# EasyEDA schematic Mainboard Schematic - 0.3A.json

## Sheets
1 CPU: TITLE: Turaco: CPU; REV: 0.3A; Date: 2023-04-29; Drawn By: Kyle J Cardoza; Company: Studio 8502
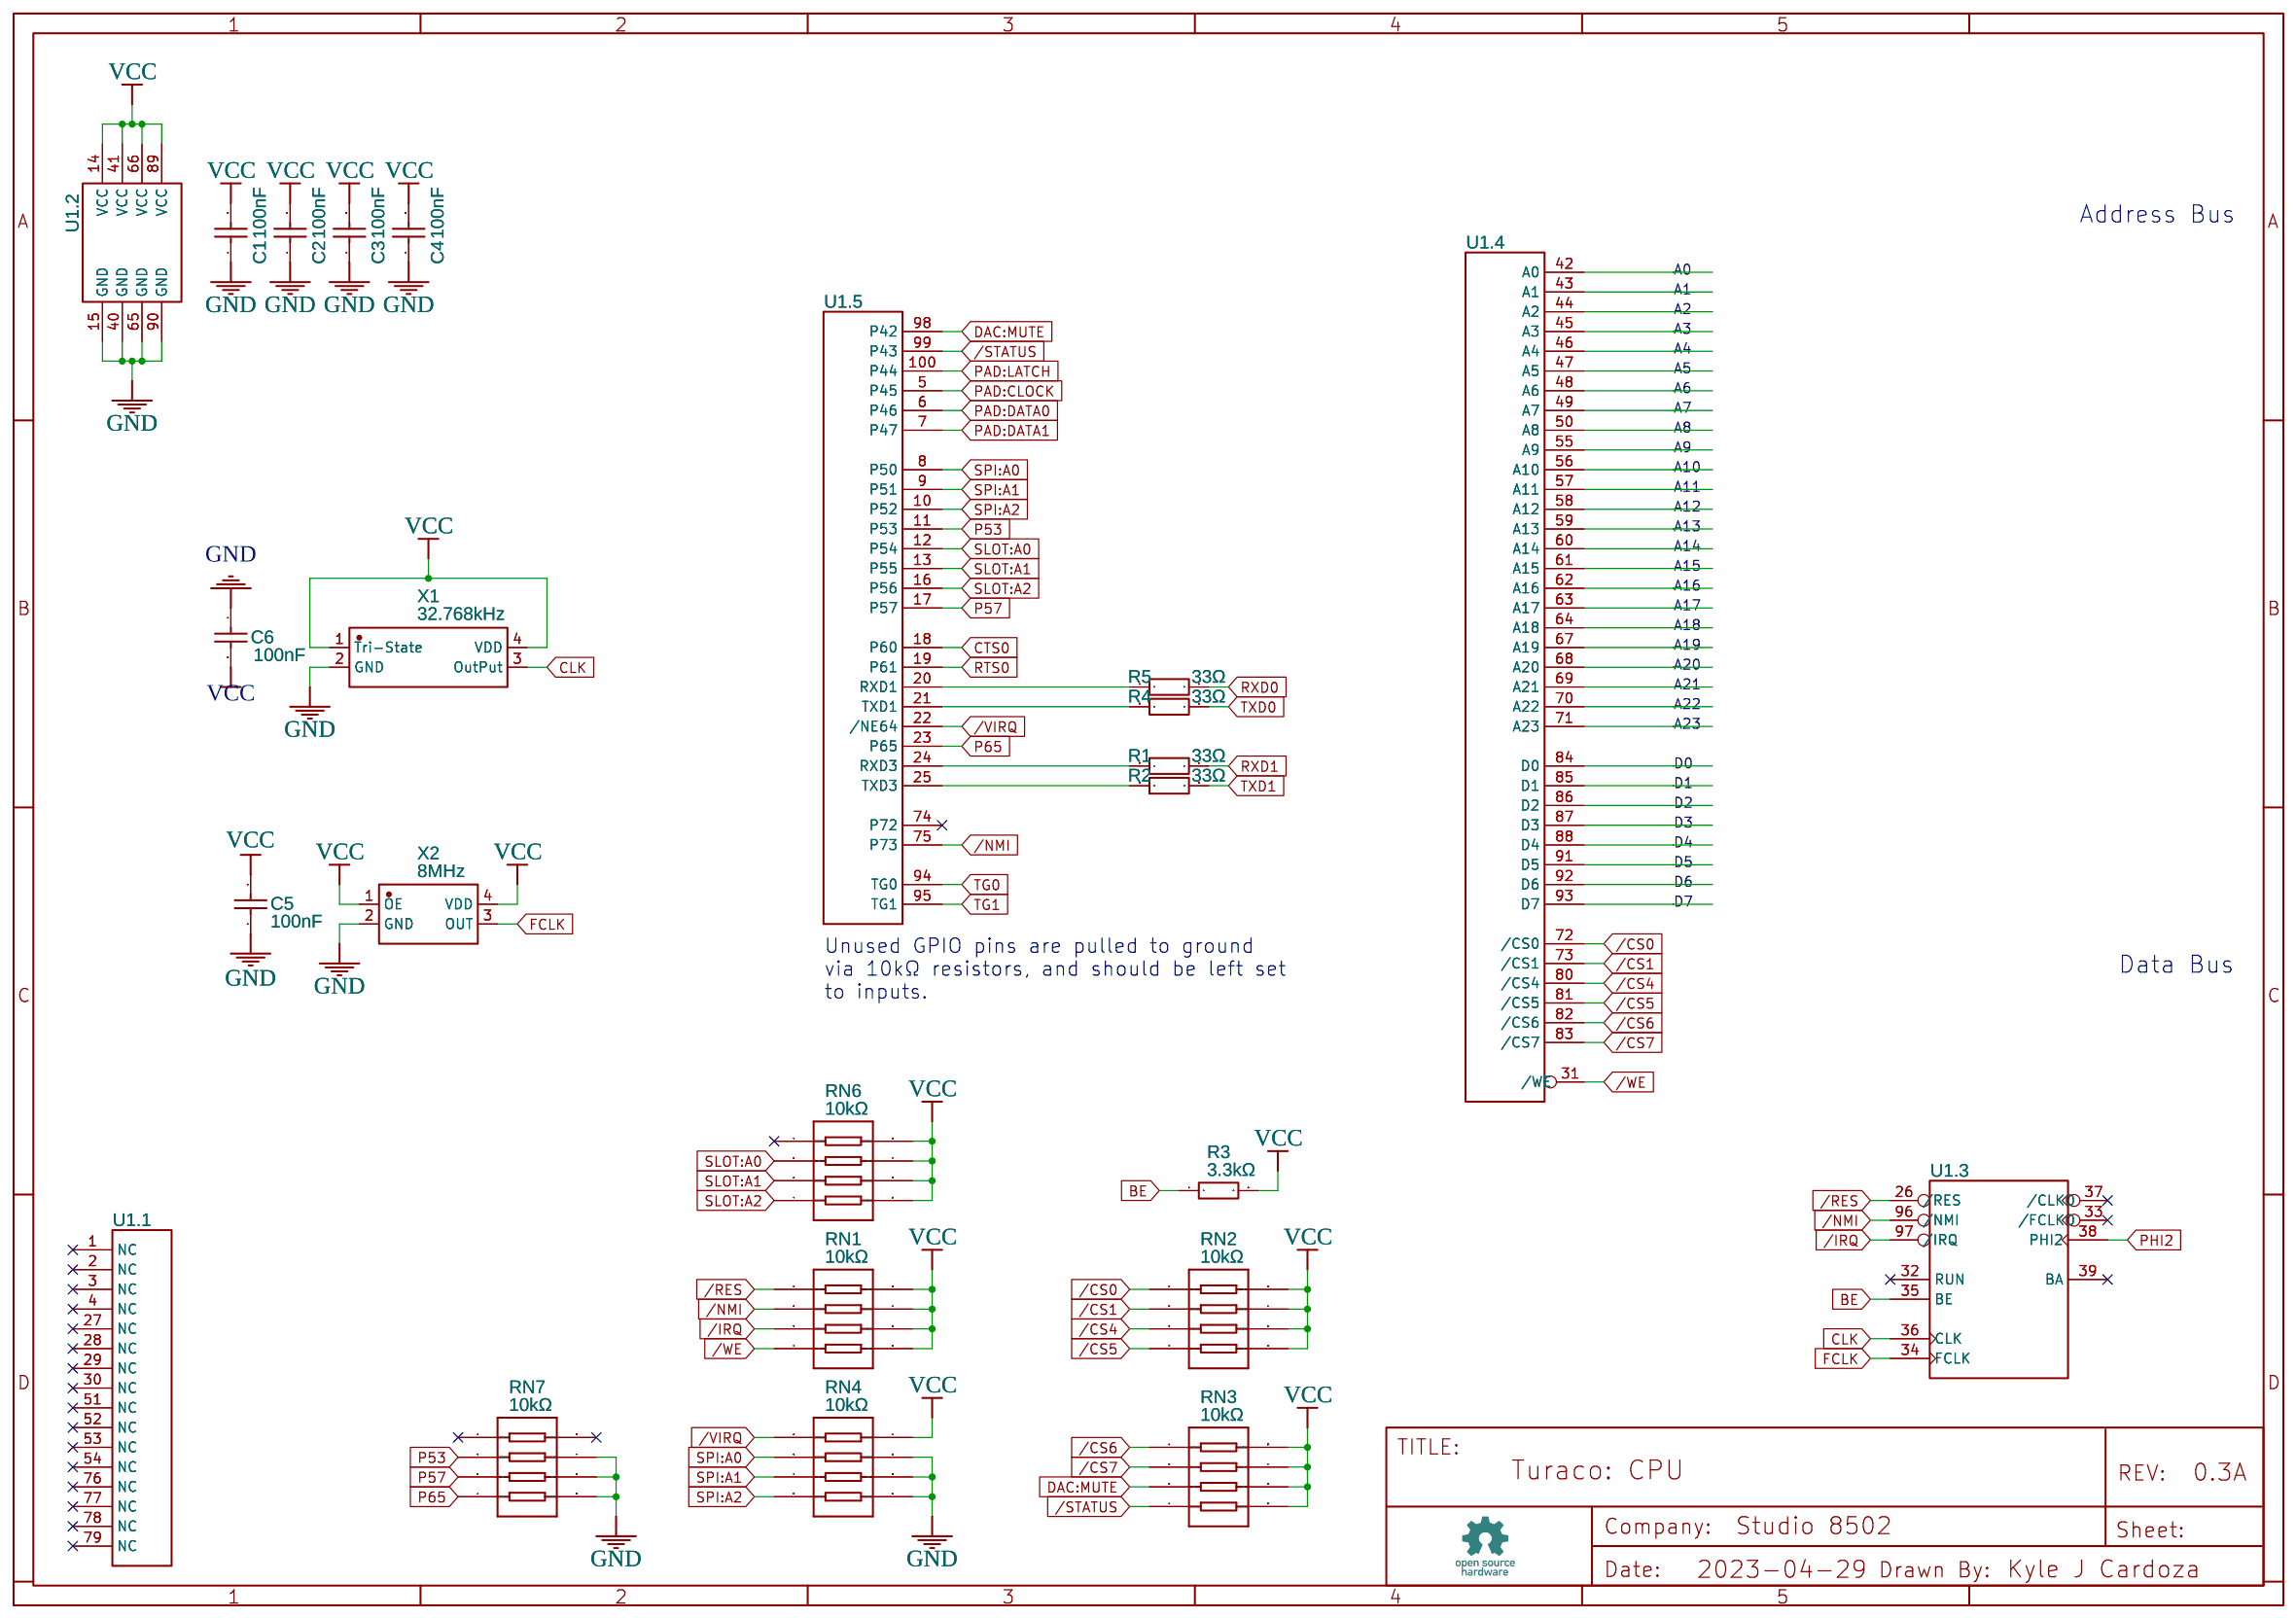
[diagram p0: CPU]
2 Glue Logic: TITLE: Turaco: Glue Logic
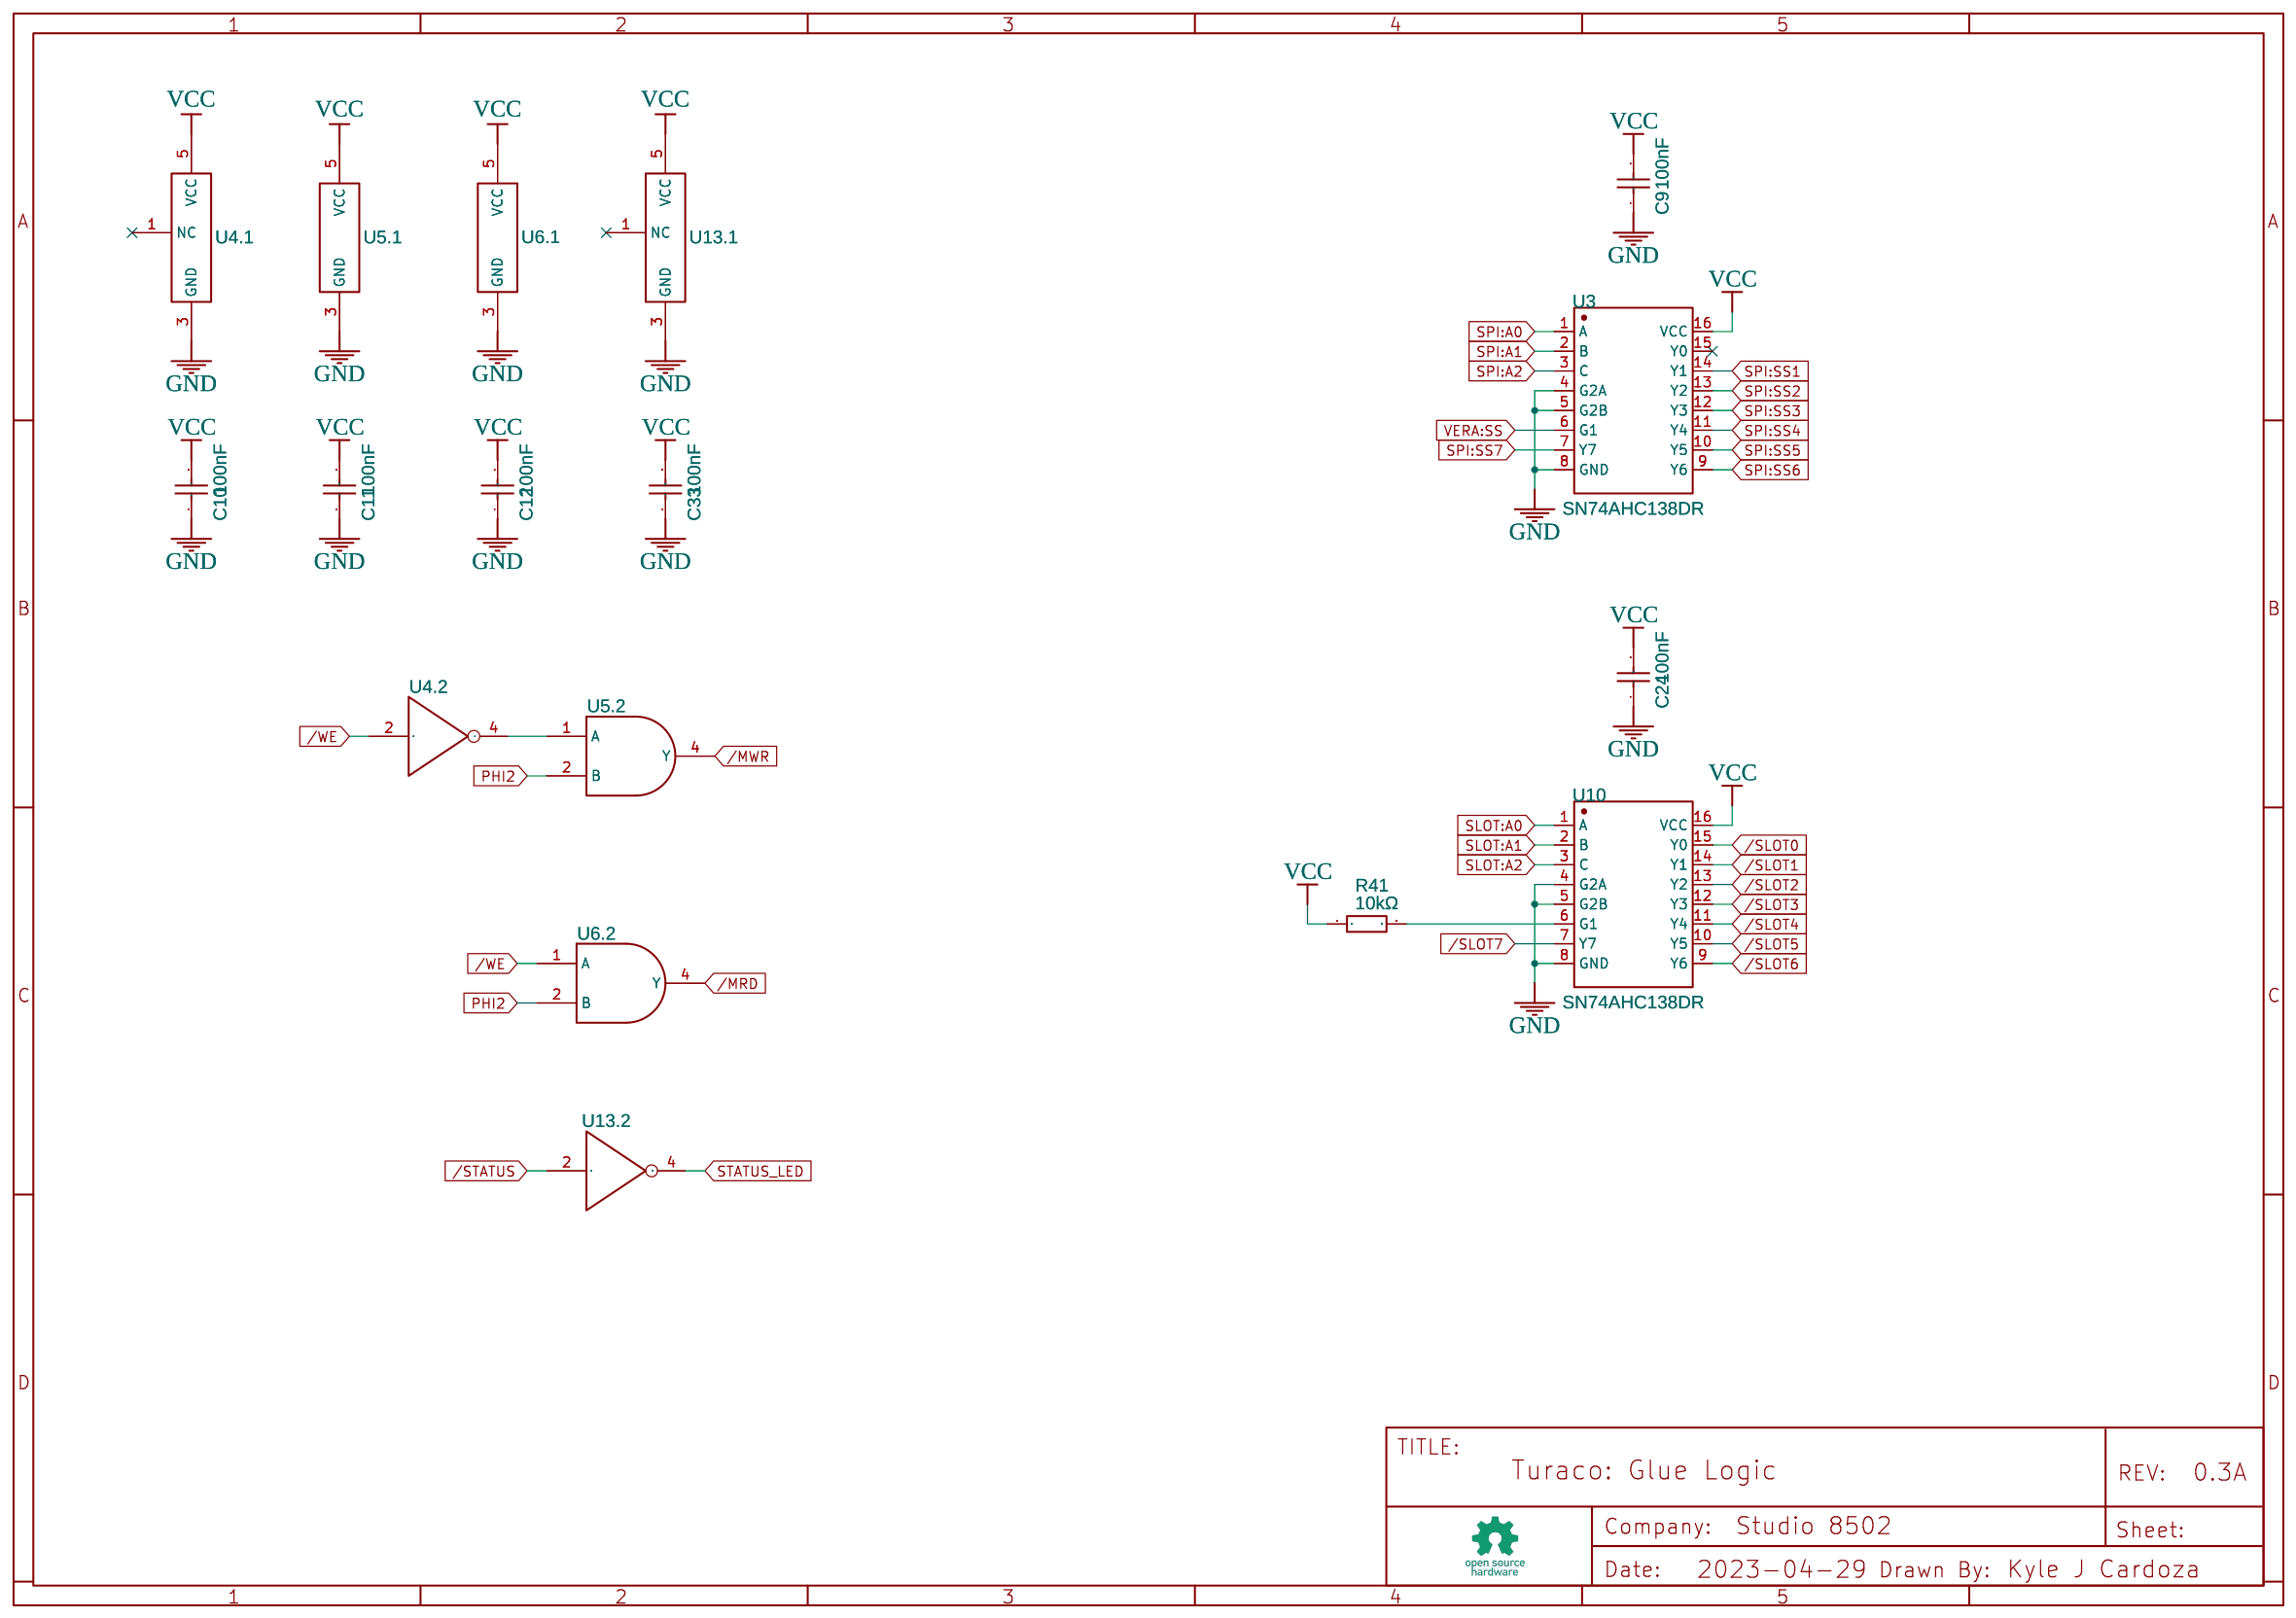
[diagram p1: Glue Logic]
3 Main Memory: TITLE: Main Memory
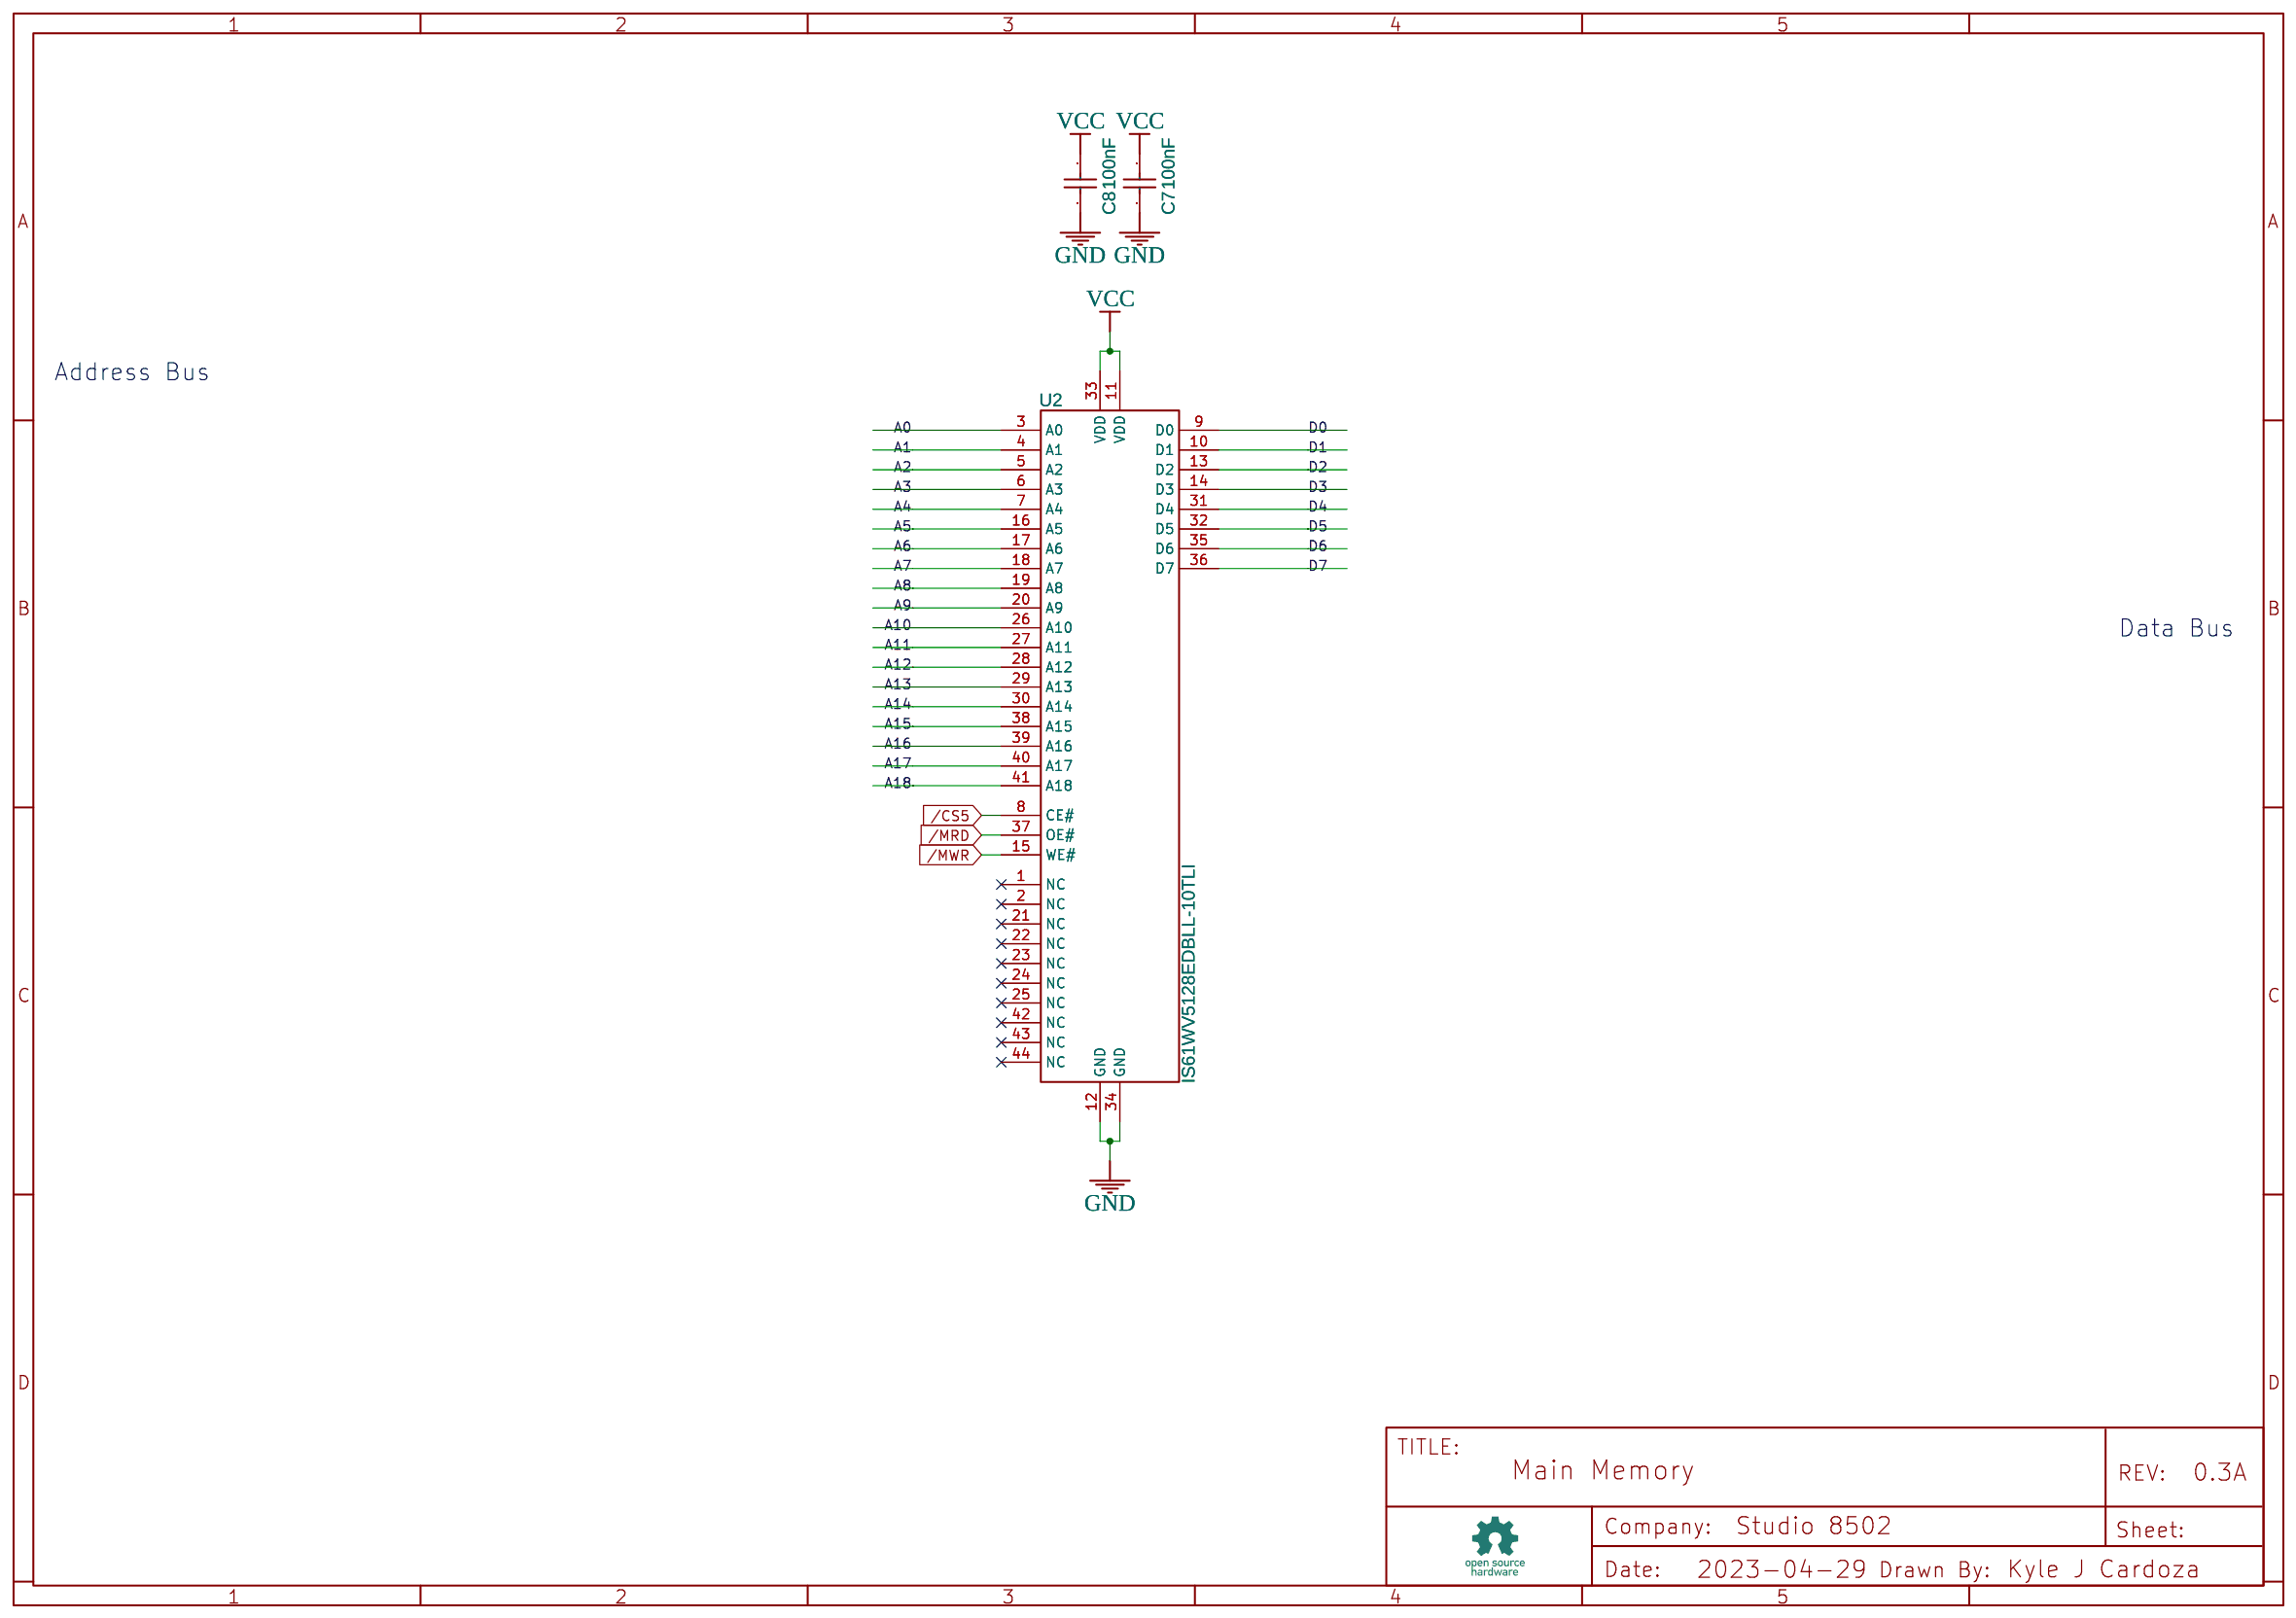
[diagram p2: Main Memory]
4 Video Controller: TITLE: Turaco: Video Controller
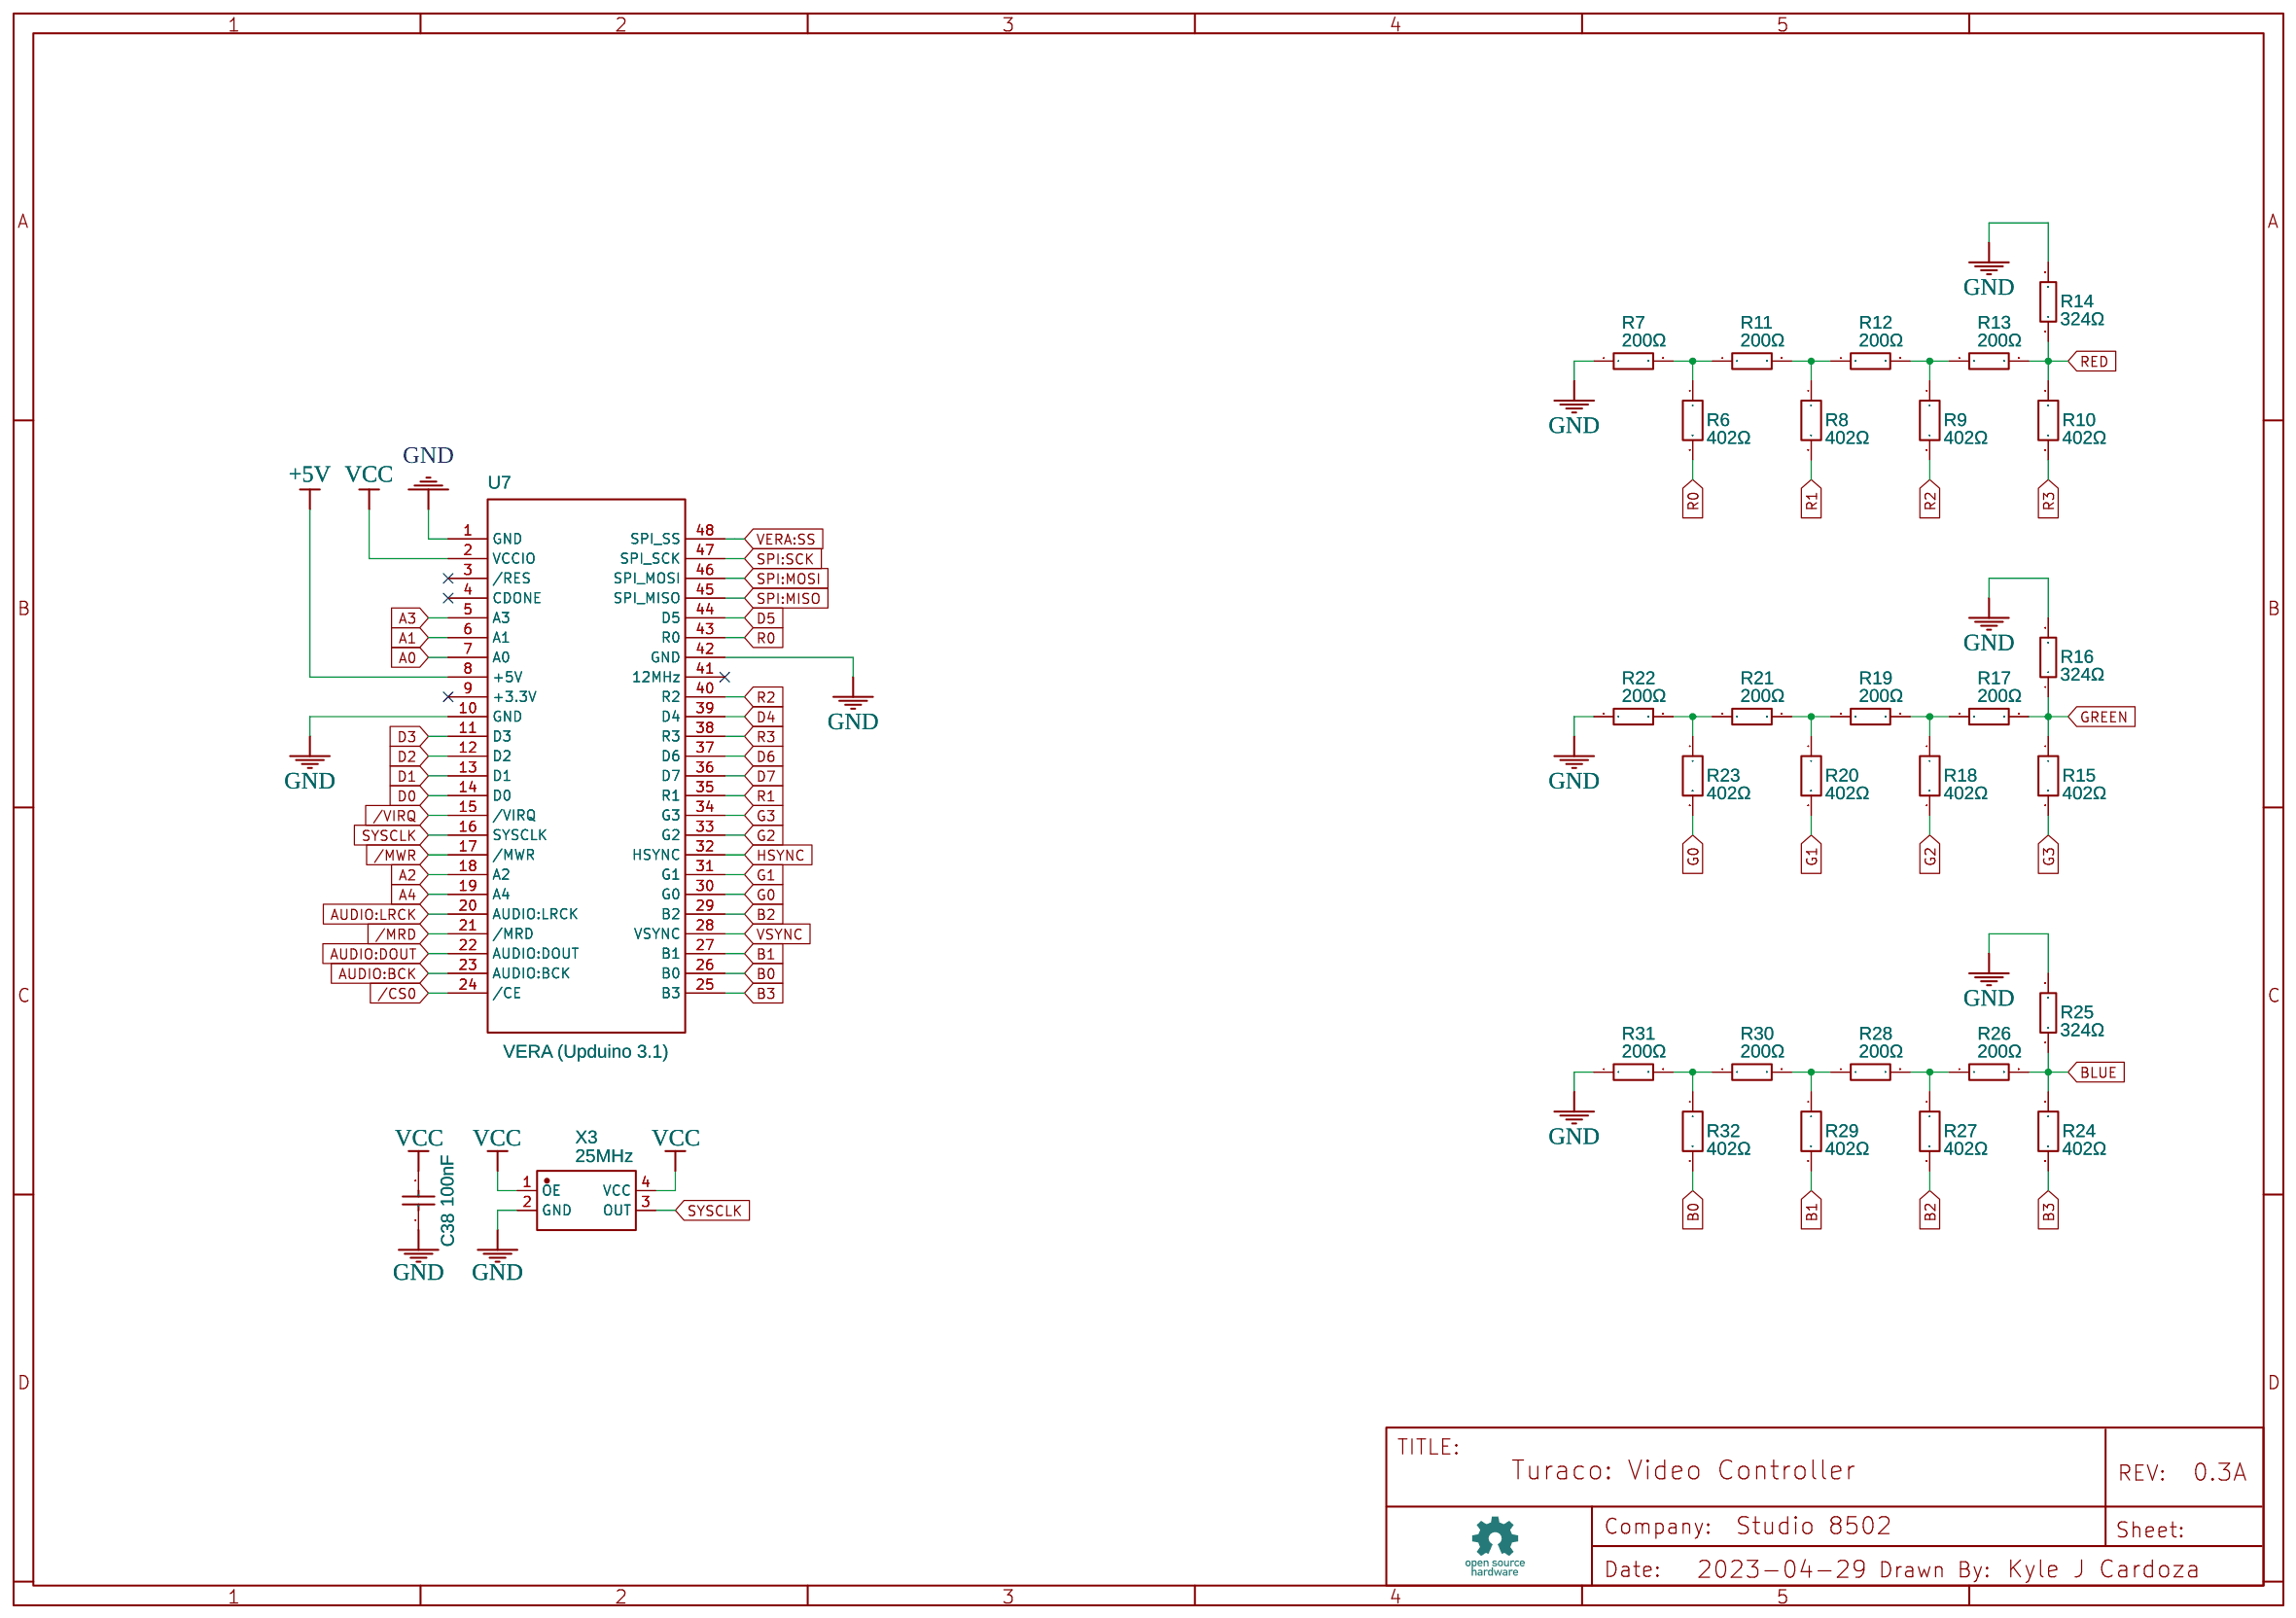
[diagram p3: Video Controller]
5 Keyboard Controller: TITLE: Turaco: Keyboard Controller
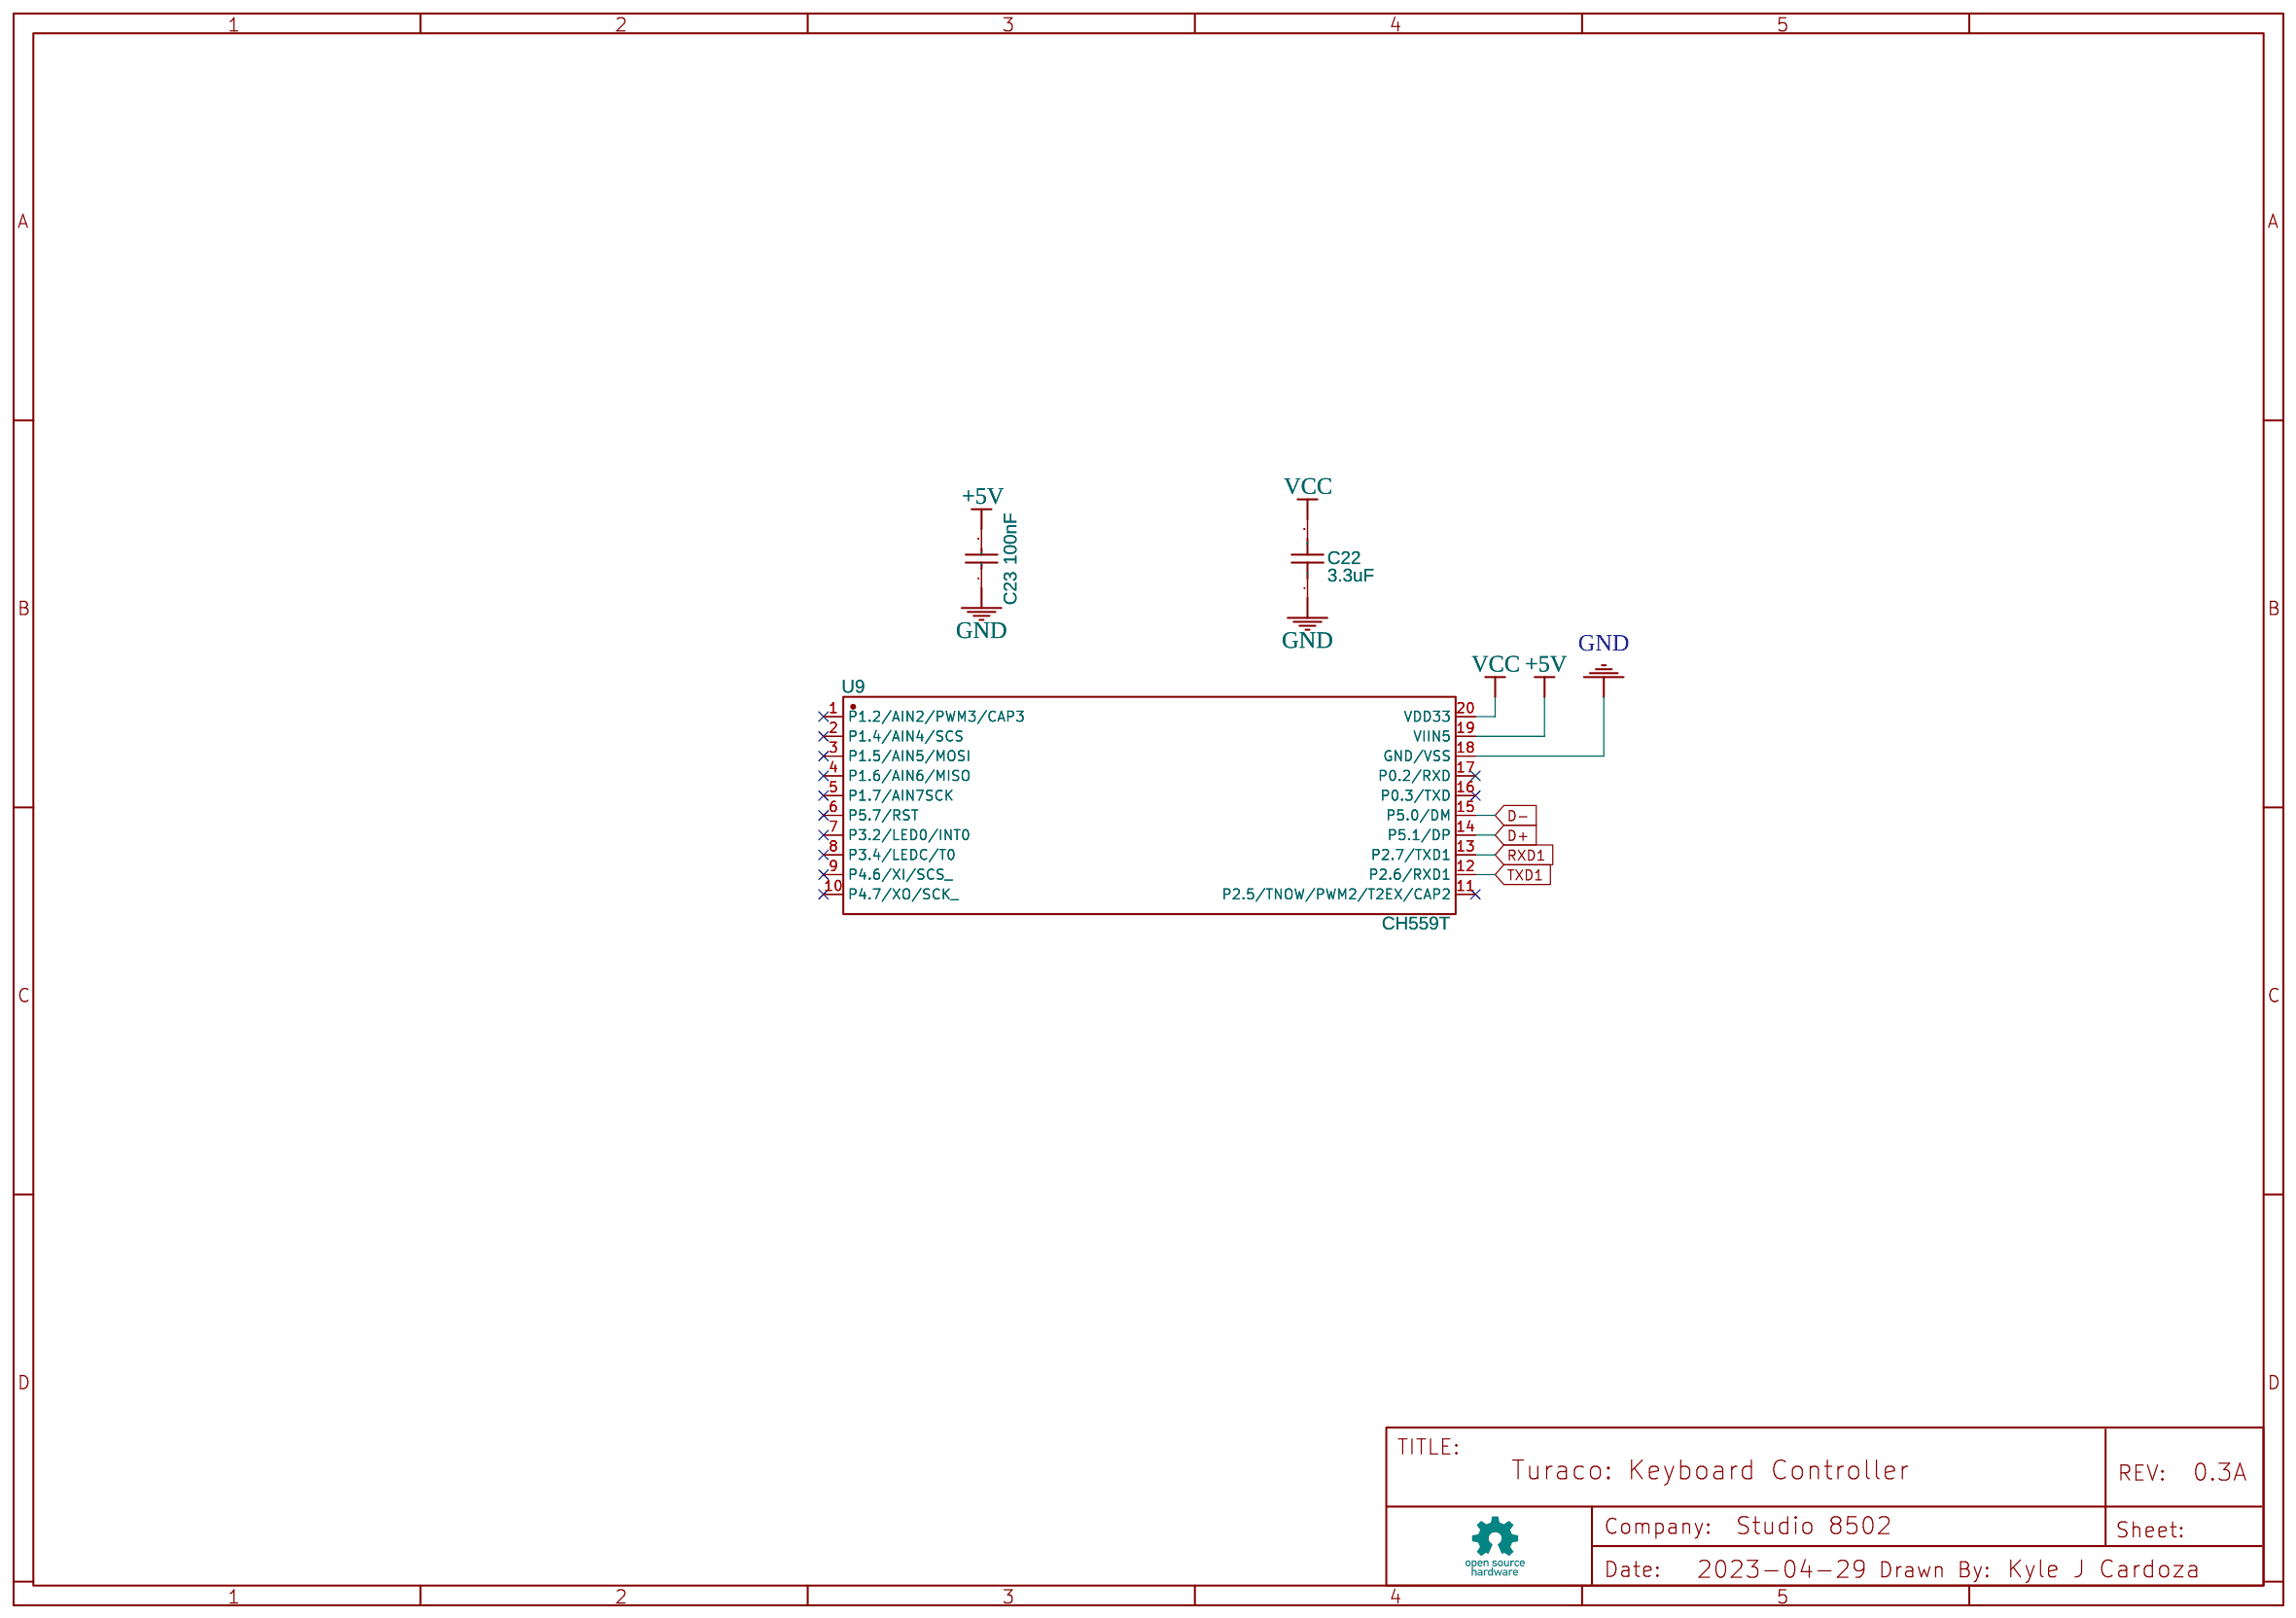
[diagram p4: Keyboard Controller]
6 Audio DAC: TITLE: Turaco: Audio
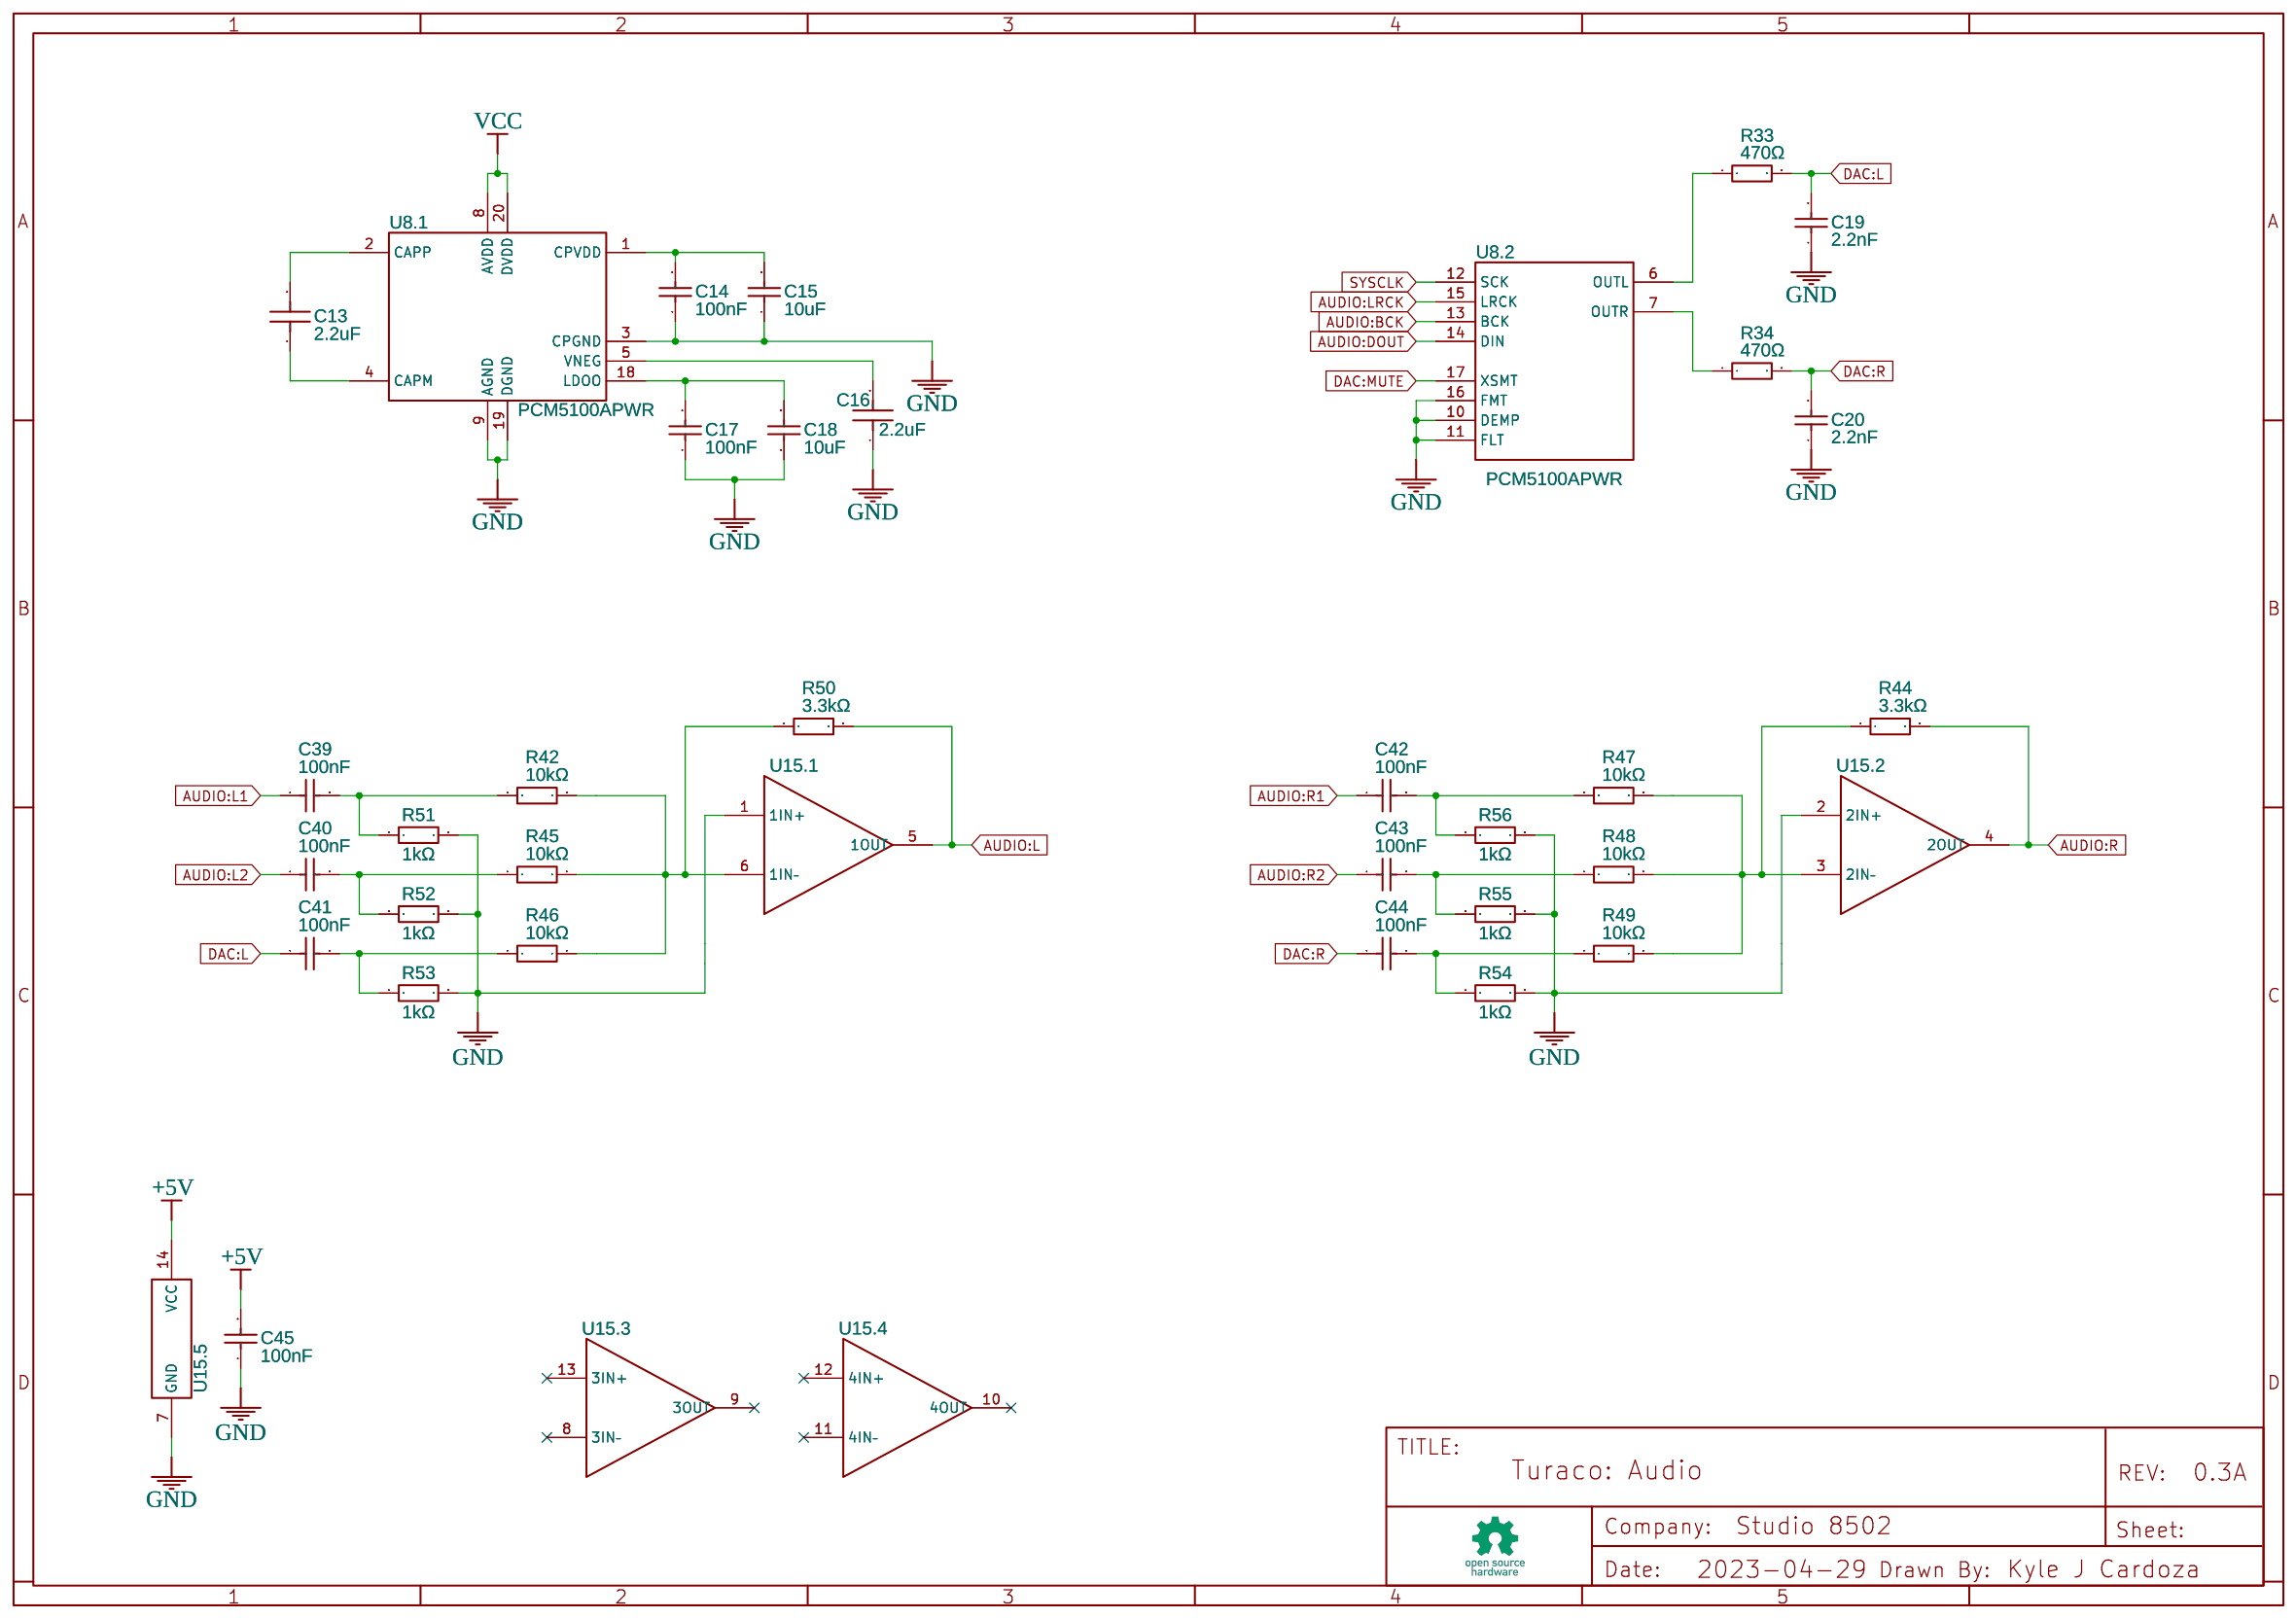
[diagram p5: Audio DAC]
7 RTC: TITLE: RTC; Date: 2023-05-05
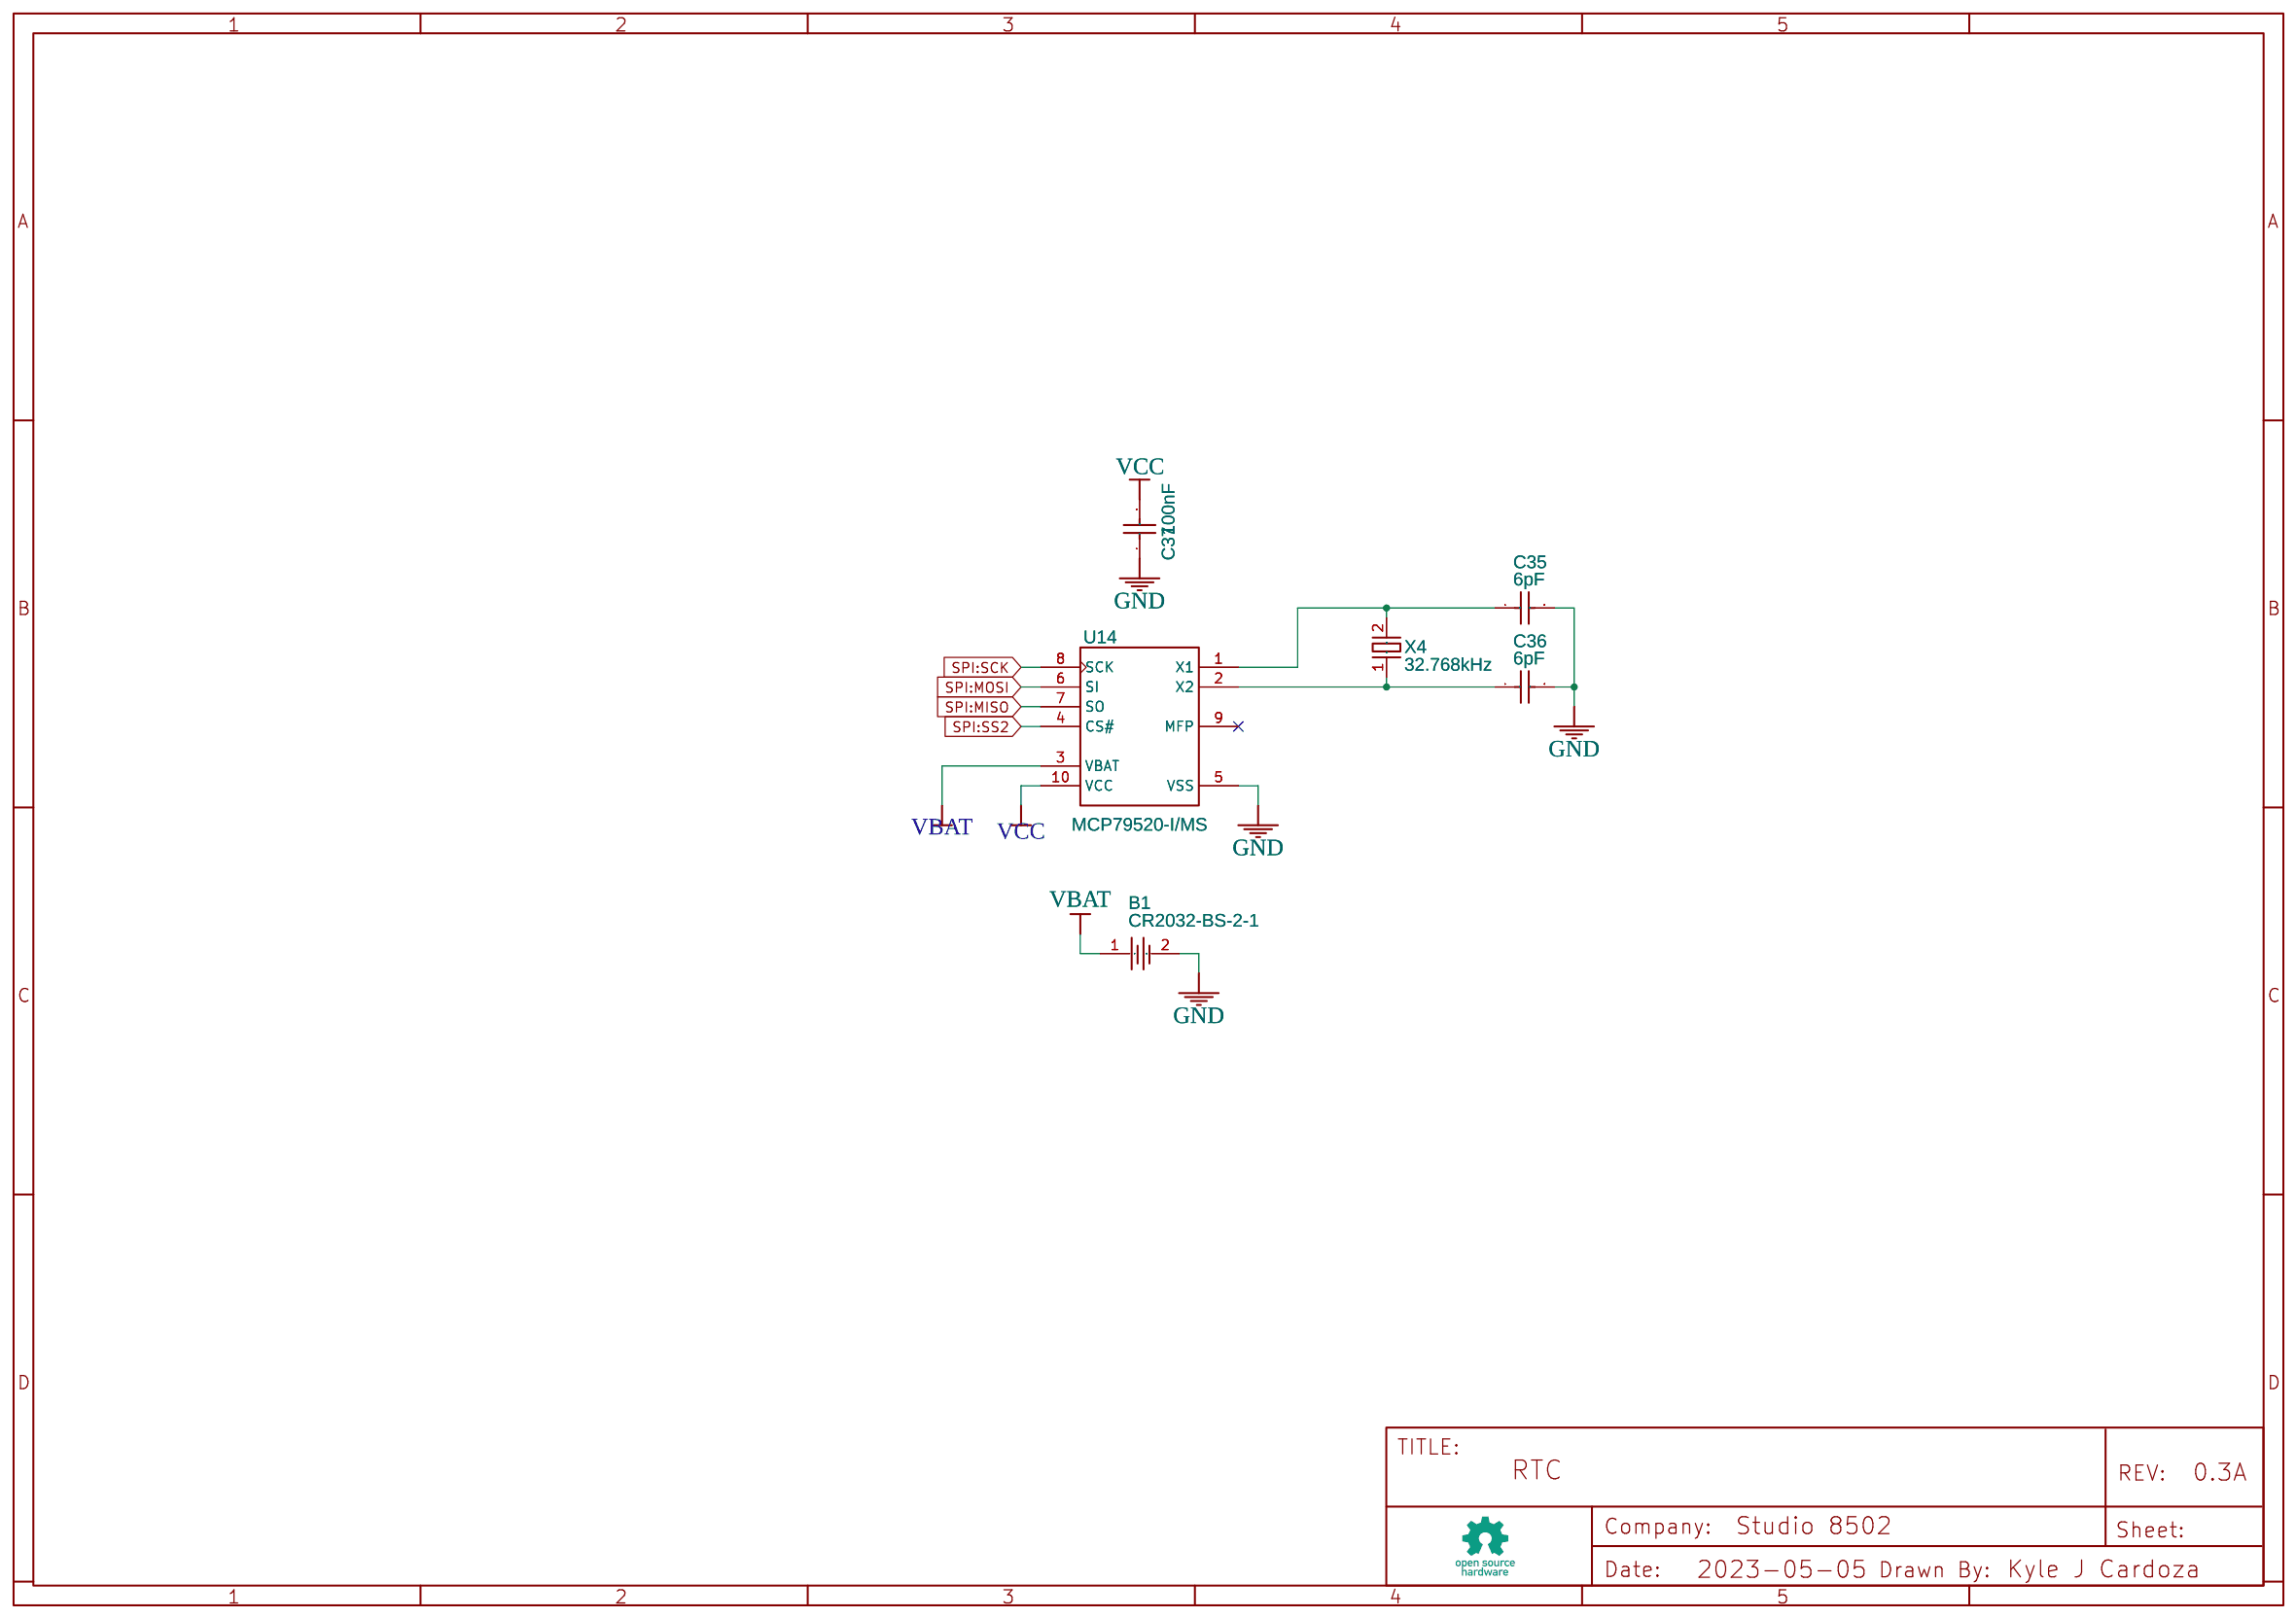
[diagram p6: RTC]
8 Expansion: TITLE: Turaco: Expansion
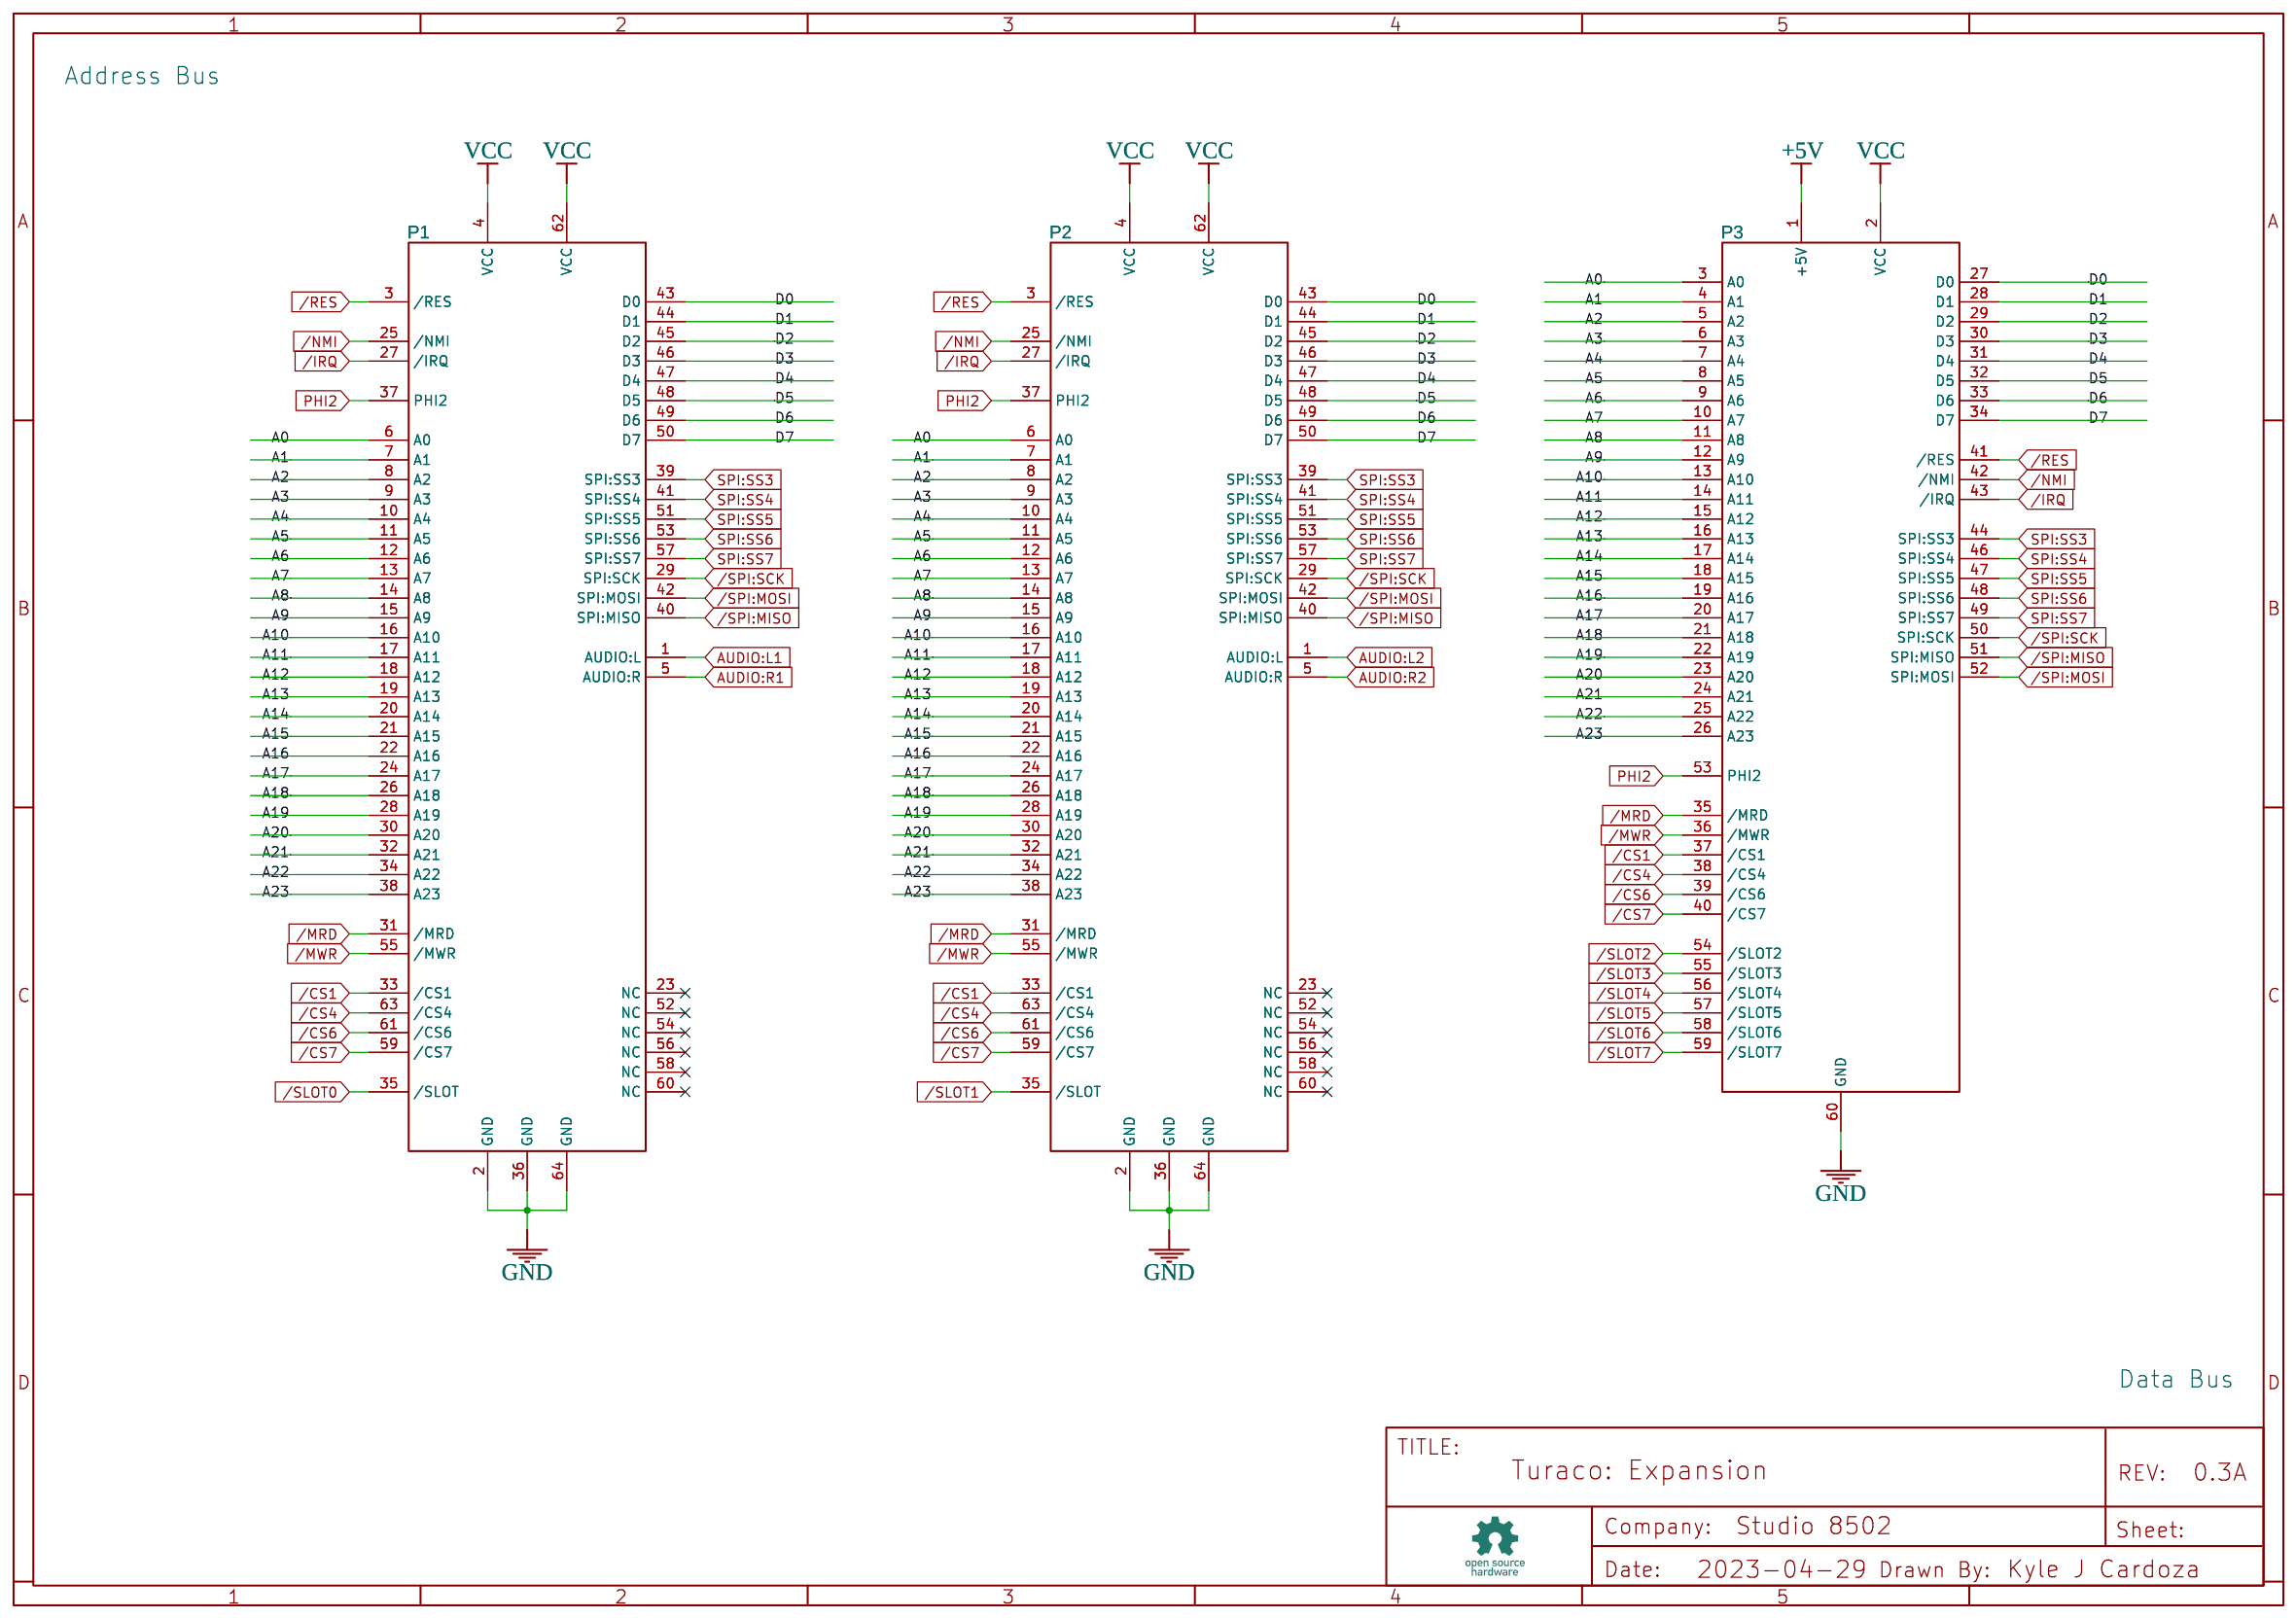
[diagram p7: Expansion]
9 Ports: TITLE: Turaco: Ports
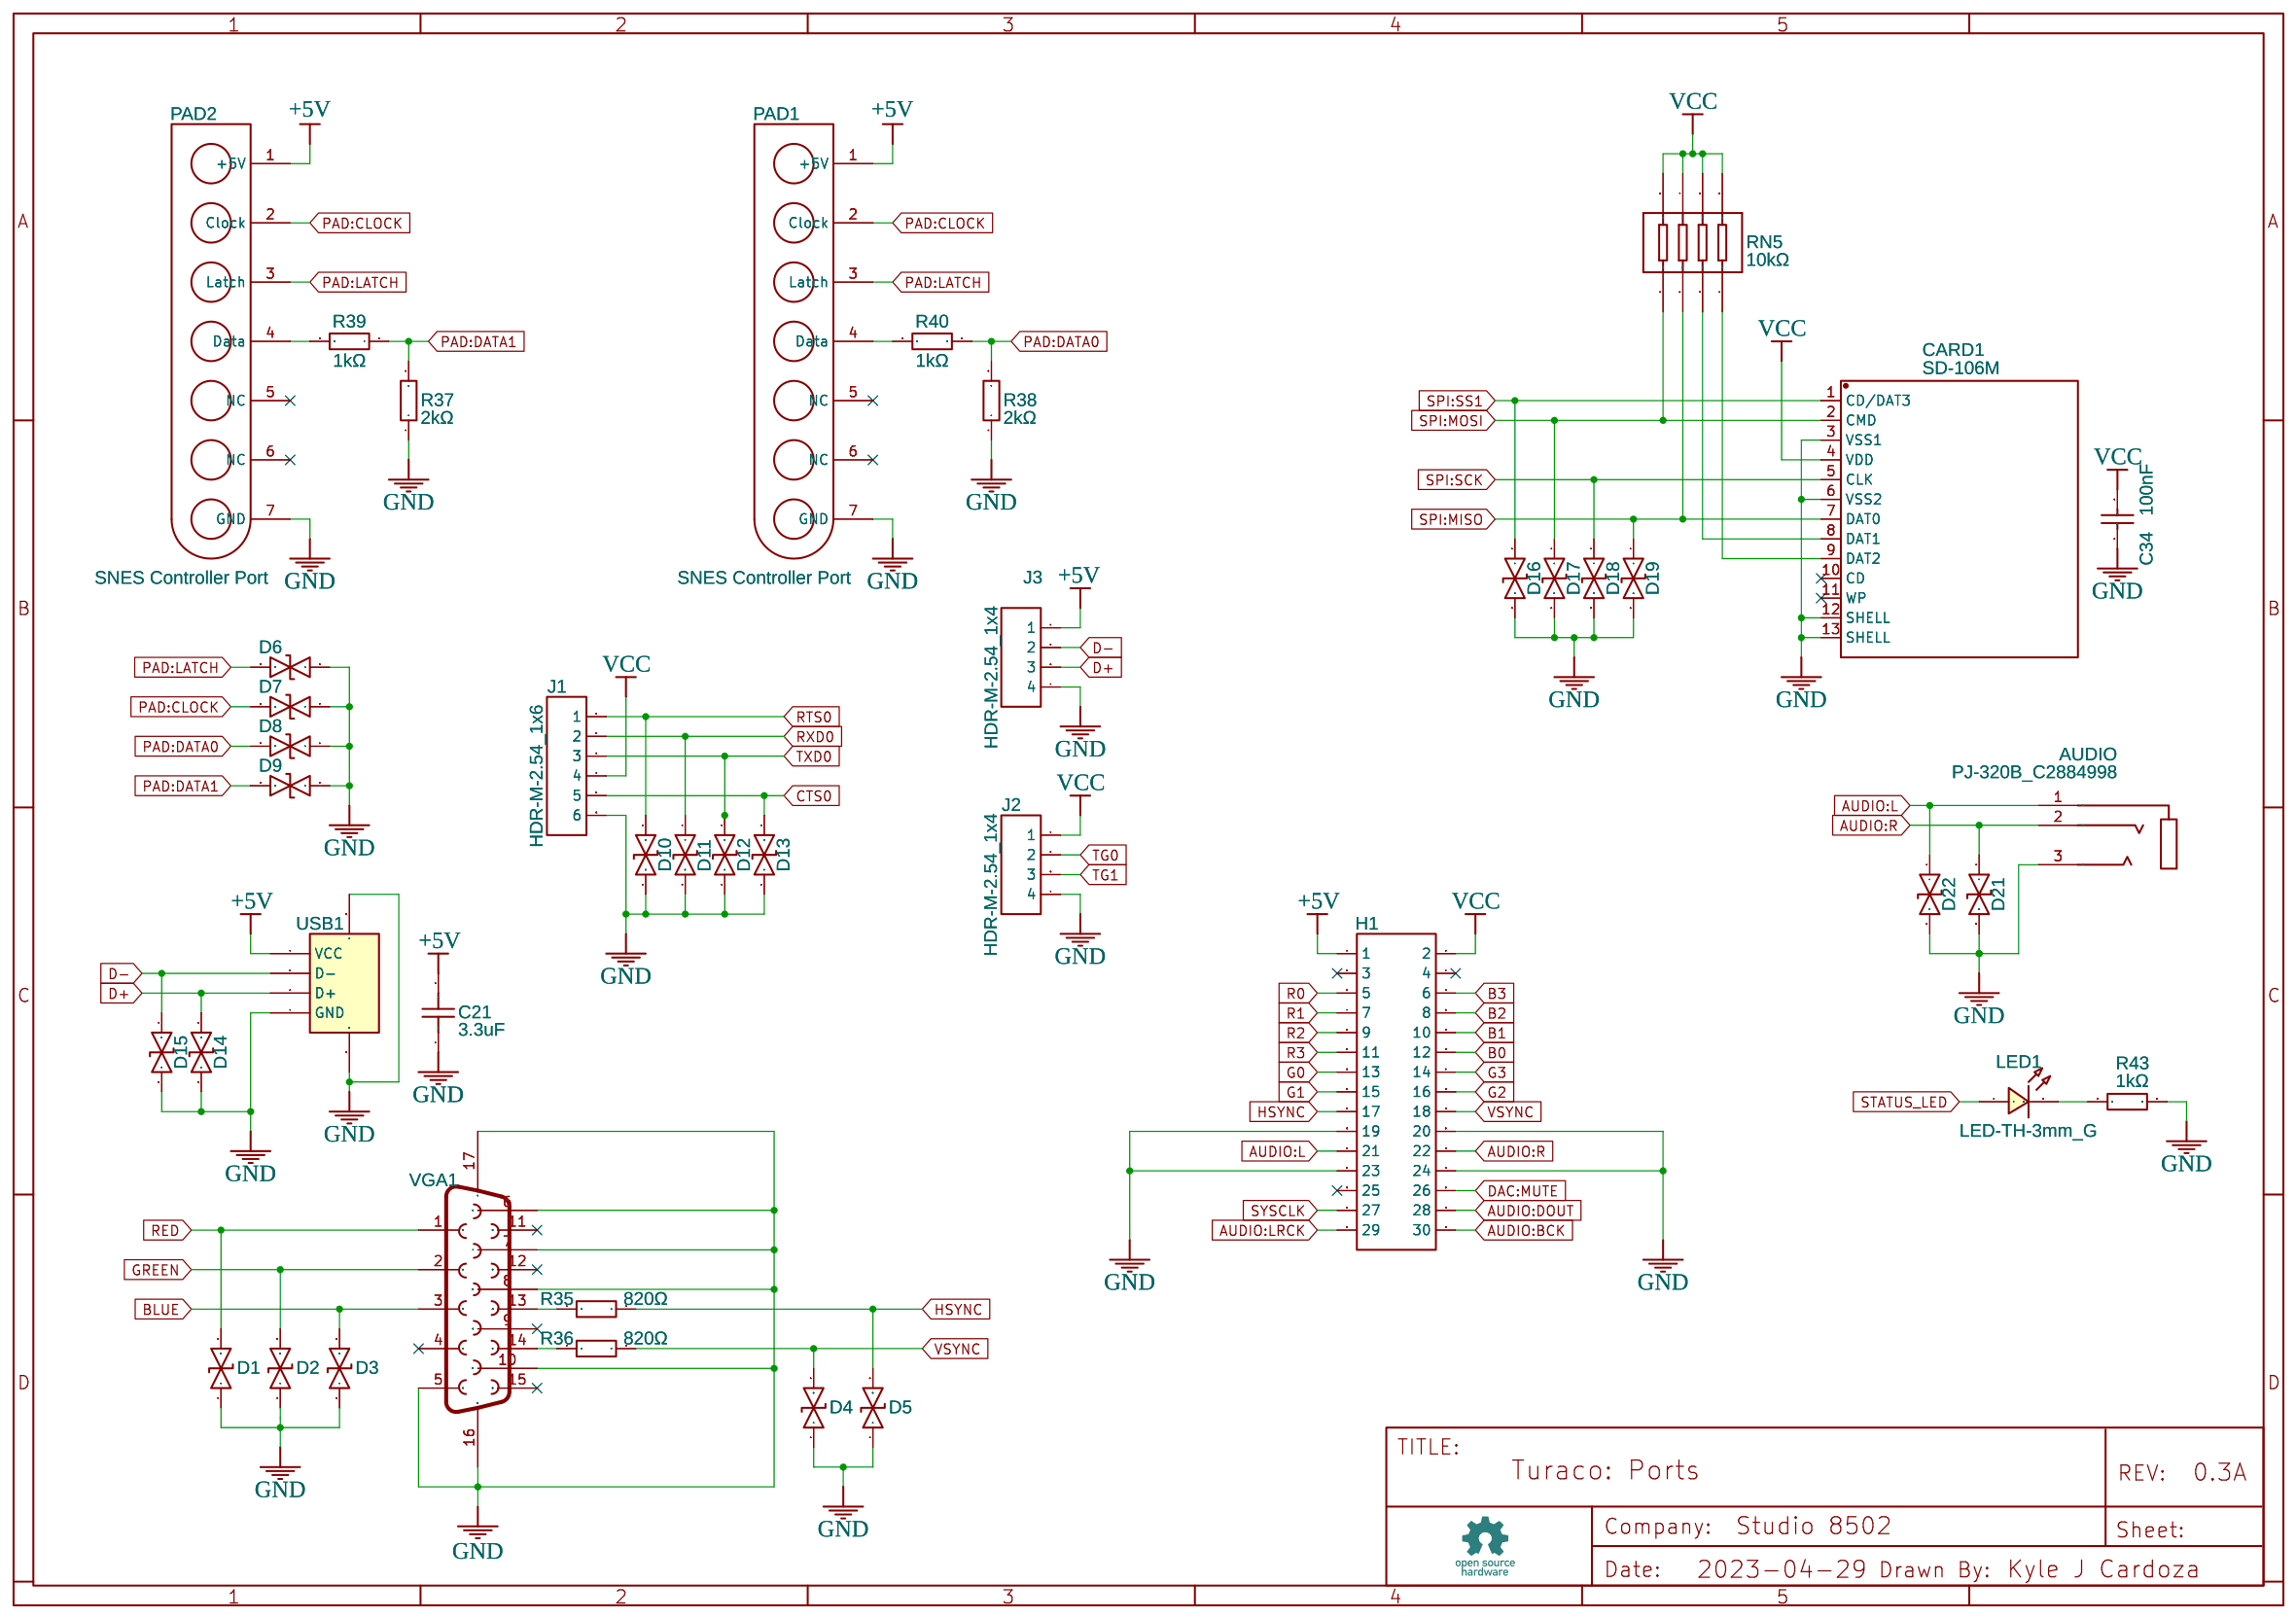
[diagram p8: Ports]
10 Power Supply: TITLE: Turaco: Power Supply
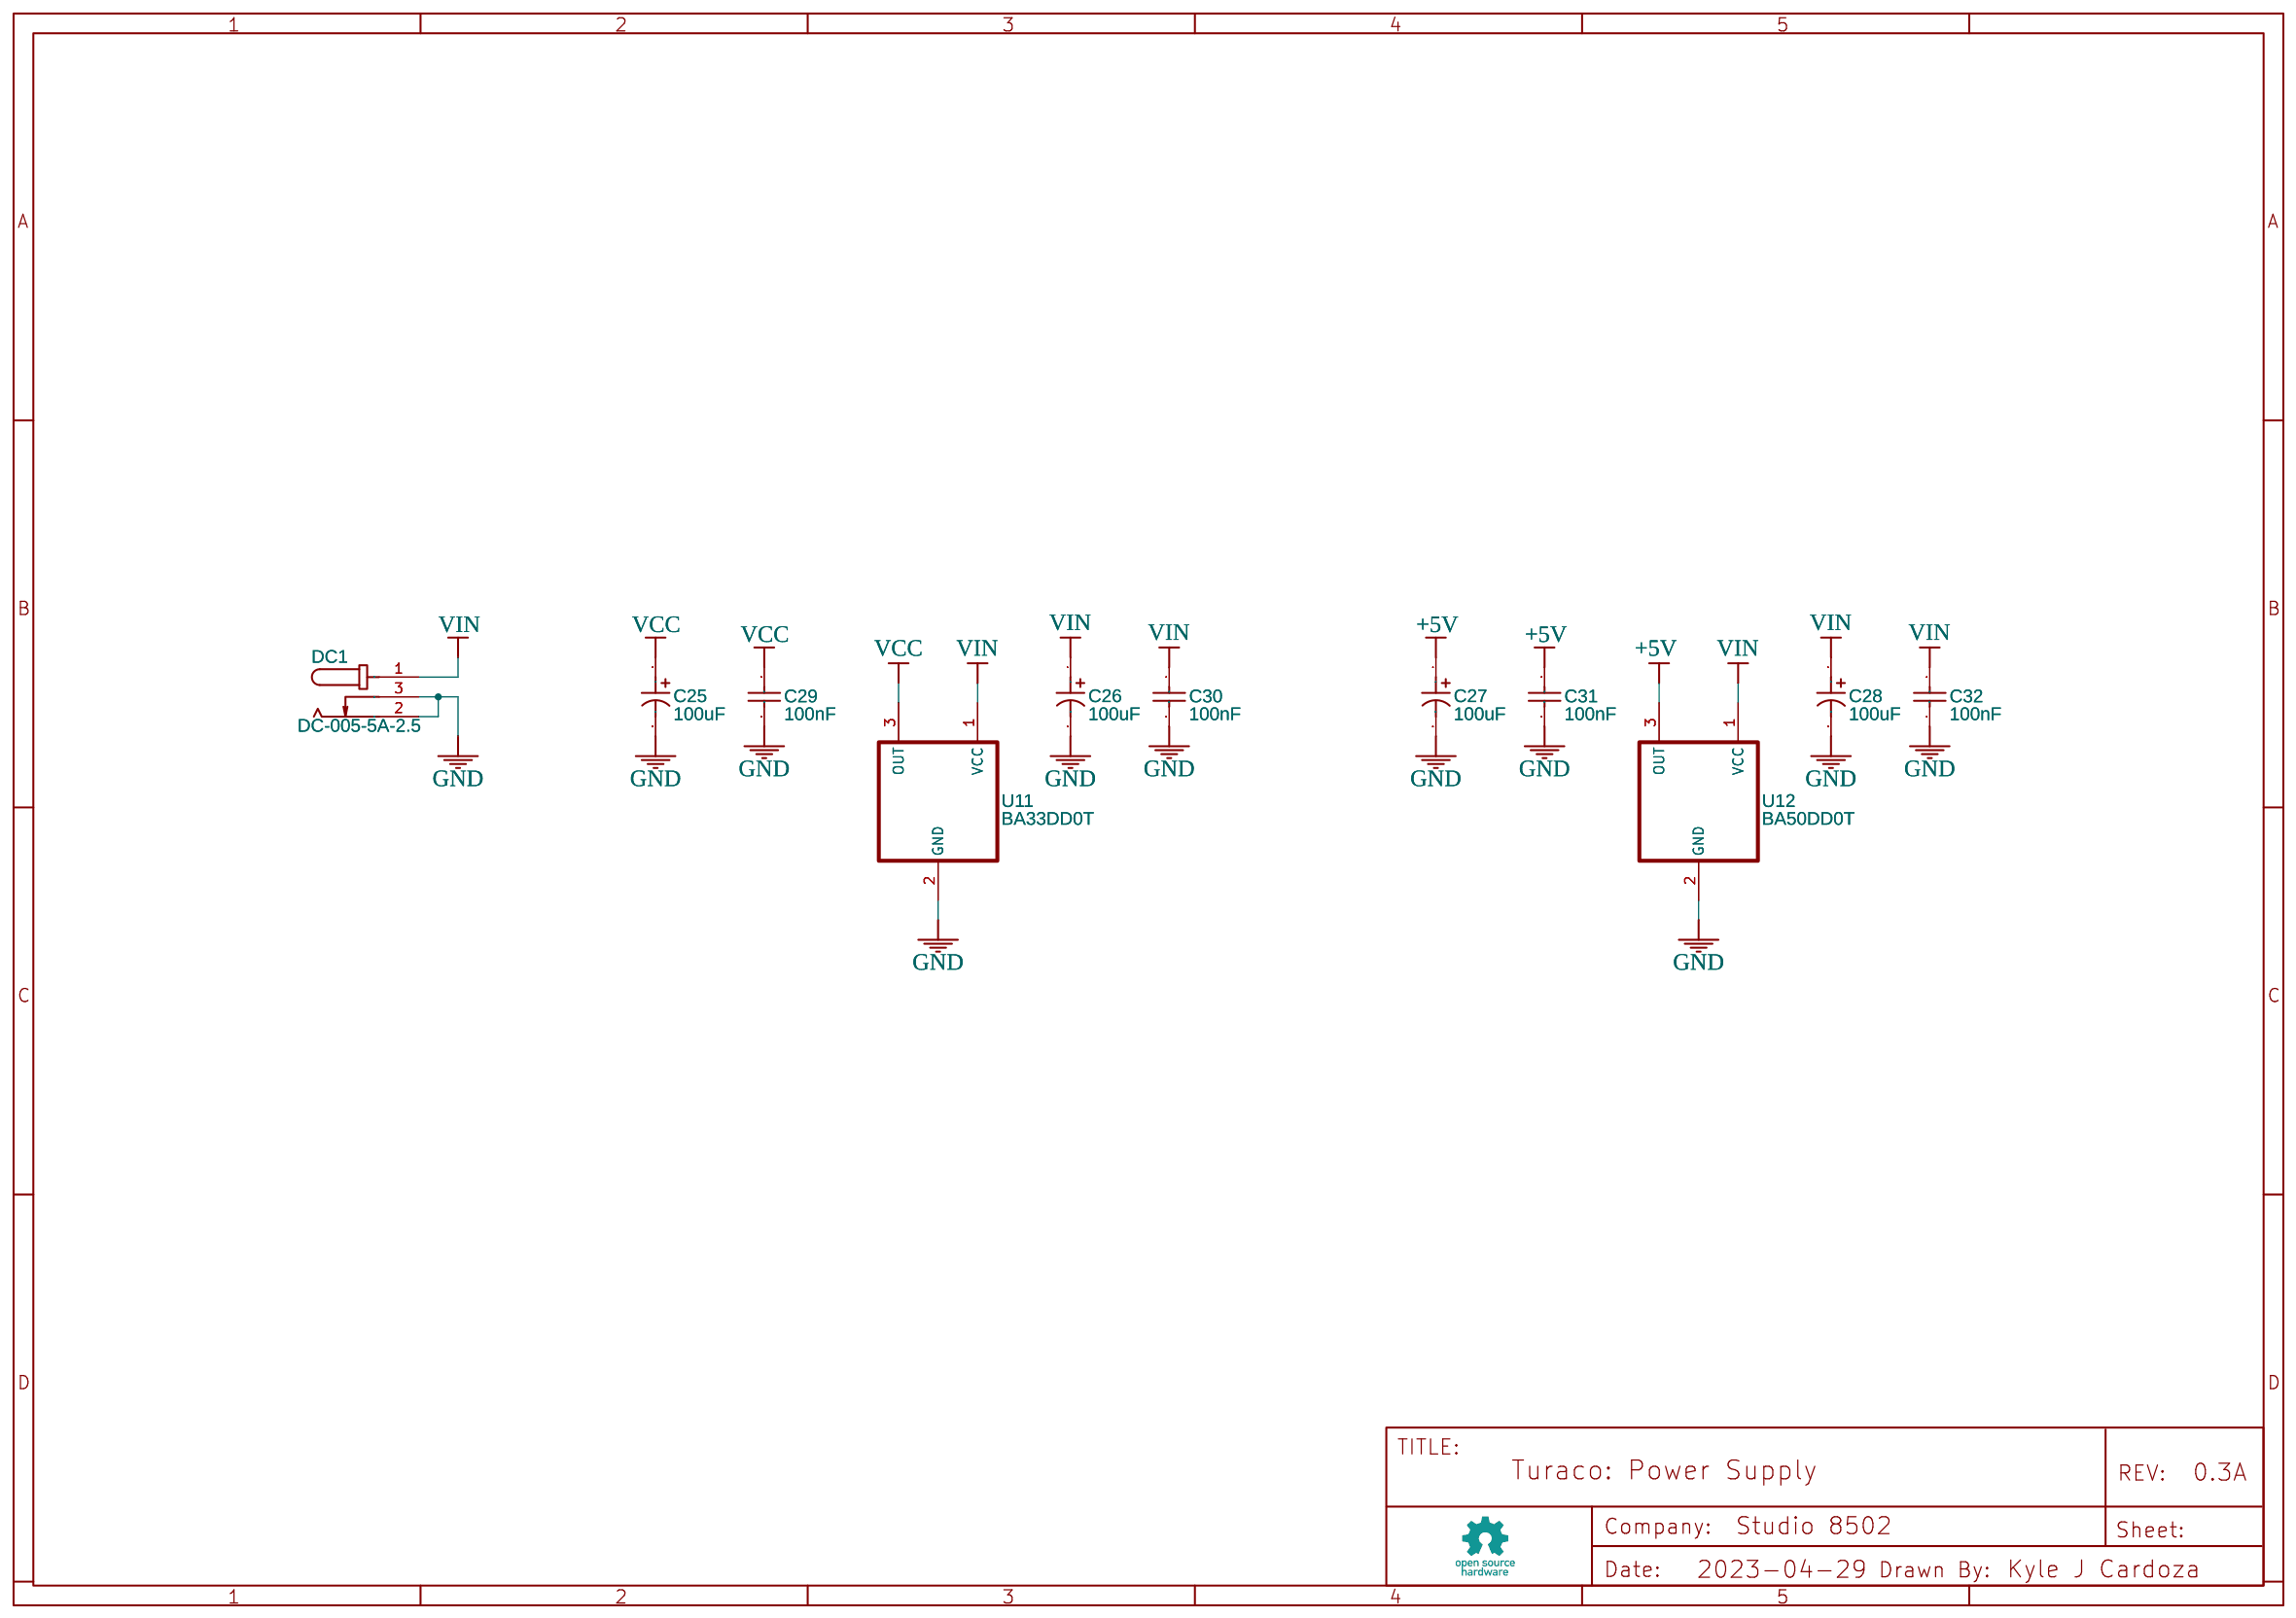
[diagram p9: Power Supply]

## Parts
sheet Audio DAC
C13  2.2uF  [C0402]
C14  100nF  [C0402]
C15  10uF  [C0805]
C16  2.2uF  [C0402]
C17  100nF  [C0402]
C18  10uF  [C0805]
C19  2.2nF  [C0402]
C20  2.2nF  [C0402]
C39  100nF  [C0402]
C40  100nF  [C0402]
C41  100nF  [C0402]
C42  100nF  [C0402]
C43  100nF  [C0402]
C44  100nF  [C0402]
C45  100nF  [C0402]
R33  470Ω  [R0402]
R34  470Ω  [R0402]
R42  10kΩ  [R0402]
R44  3.3kΩ  [R0402]
R45  10kΩ  [R0402]
R46  10kΩ  [R0402]
R47  10kΩ  [R0402]
R48  10kΩ  [R0402]
R49  10kΩ  [R0402]
R50  3.3kΩ  [R0402]
R51  1kΩ  [R0402]
R52  1kΩ  [R0402]
R53  1kΩ  [R0402]
R54  1kΩ  [R0402]
R55  1kΩ  [R0402]
R56  1kΩ  [R0402]
U8  PCM5100APWR  [TSSOP-20_L6.5-W4.4-P0.65-LS6.4-BL]  (sections 1,2)
U15  LM3900DR  [SOIC-14_L8.7-W3.9-P1.27-LS6.0-BL]  (sections 1,2,3,4,5)
sheet CPU
C1  100nF  [C0402]
C2  100nF  [C0402]
C3  100nF  [C0402]
C4  100nF  [C0402]
C5  100nF  [C0402]
C6  100nF  [C0402]
R1  33Ω  [R0402]
R2  33Ω  [R0402]
R3  3.3kΩ  [R0402]
R4  33Ω  [R0402]
R5  33Ω  [R0402]
RN1  10kΩ  [RES-ARRAY-SMD_0402-8P-L2.0-W1.0-BL]
RN2  10kΩ  [RES-ARRAY-SMD_0402-8P-L2.0-W1.0-BL]
RN3  10kΩ  [RES-ARRAY-SMD_0402-8P-L2.0-W1.0-BL]
RN4  10kΩ  [RES-ARRAY-SMD_0402-8P-L2.0-W1.0-BL]
RN6  10kΩ  [RES-ARRAY-SMD_0402-8P-L2.0-W1.0-BL]
RN7  10kΩ  [RES-ARRAY-SMD_0402-8P-L2.0-W1.0-BL]
U1  W65C265S8QG-8  [TQFP-100_L14.0-W14.0-P0.50-LS16.0-BL-EP9.5]  (sections 1,2,3,4,5)
X1  32.768kHz  [OSC-SMD_4P-L3.2-W2.5-BL-1]
X2  8MHz  [OSC-SMD_4P-L3.2-W2.5-BL]
sheet Expansion
P1  Turaco Cartridge (Female Edge Connector)  [EDAC 395-062-520-350 EDGE CONNECTOR - F-62P-P2.54]
P2  Turaco Cartridge (Female Edge Connector)  [EDAC 395-062-520-350 EDGE CONNECTOR - F-62P-P2.54]
P3  TURACO BACKPLANE (MALE EDGE CONNECTOR)  [TURACO BACKPLANE CONNECTOR (MALE - 60P - P2.54MM) COPY]
sheet Glue Logic
C9  100nF  [C0402]
C10  100nF  [C0402]
C11  100nF  [C0402]
C12  100nF  [C0402]
C24  100nF  [C0402]
C33  100nF  [C0402]
R41  10kΩ  [R0402]
U3  SN74AHC138DR  [SOIC-16_L10.8-W4.5-P1.27-LS6.8-BL]
U4  SN74AHC1G04DCKR (NOT GATE)  [SOT-353_L2.1-W1.3-P0.65-LS2.3-BR]  (sections 1,2)
U5  SN74AHC1G08DCKR (AND GATE)  [SC-70-5_L2.1-W1.3-P0.65-LS2.1-BR]  (sections 1,2)
U6  SN74AHC1G08DCKR (AND GATE)  [SC-70-5_L2.1-W1.3-P0.65-LS2.1-BR]  (sections 1,2)
U10  SN74AHC138DR  [SOIC-16_L10.8-W4.5-P1.27-LS6.8-BL]
U13  SN74AHC1G04DCKR (NOT GATE)  [SOT-353_L2.1-W1.3-P0.65-LS2.3-BR]  (sections 1,2)
sheet Keyboard Controller
C22  3.3uF  [C0402]
C23  100nF  [C0402]
U9  CH559T  [SSOP-20_L7.5-W5.2-P0.65-LS8.0-BL]
sheet Main Memory
C7  100nF  [C0402]
C8  100nF  [C0402]
U2  IS61WV5128EDBLL-10TLI  [TSOPII-44_L18.4-W10.2-P0.80-LS11.8-BL]
sheet Ports
AUDIO  PJ-320B_C2884998  [AUDIO-SMD_PJ-320B_C2884998]
C21  3.3uF  [C0402]
C34  100nF  [C0402]
CARD1  SD-106M  [SD-SMD_SD-106M]
D1  PESD3V3L1BA-N  [SOD-323_L1.8-W1.3-LS2.5-BI]
D2  PESD3V3L1BA-N  [SOD-323_L1.8-W1.3-LS2.5-BI]
D3  PESD3V3L1BA-N  [SOD-323_L1.8-W1.3-LS2.5-BI]
D4  PESD3V3L1BA-N  [SOD-323_L1.8-W1.3-LS2.5-BI]
D5  PESD3V3L1BA-N  [SOD-323_L1.8-W1.3-LS2.5-BI]
D6  PESD3V3L1BA-N  [SOD-323_L1.8-W1.3-LS2.5-BI]
D7  PESD3V3L1BA-N  [SOD-323_L1.8-W1.3-LS2.5-BI]
D8  PESD3V3L1BA-N  [SOD-323_L1.8-W1.3-LS2.5-BI]
D9  PESD3V3L1BA-N  [SOD-323_L1.8-W1.3-LS2.5-BI]
D10  PESD3V3L1BA-N  [SOD-323_L1.8-W1.3-LS2.5-BI]
D11  PESD3V3L1BA-N  [SOD-323_L1.8-W1.3-LS2.5-BI]
D12  PESD3V3L1BA-N  [SOD-323_L1.8-W1.3-LS2.5-BI]
D13  PESD3V3L1BA-N  [SOD-323_L1.8-W1.3-LS2.5-BI]
D14  PESD3V3L1BA-N  [SOD-323_L1.8-W1.3-LS2.5-BI]
D15  PESD3V3L1BA-N  [SOD-323_L1.8-W1.3-LS2.5-BI]
D16  PESD3V3L1BA-N  [SOD-323_L1.8-W1.3-LS2.5-BI]
D17  PESD3V3L1BA-N  [SOD-323_L1.8-W1.3-LS2.5-BI]
D18  PESD3V3L1BA-N  [SOD-323_L1.8-W1.3-LS2.5-BI]
D19  PESD3V3L1BA-N  [SOD-323_L1.8-W1.3-LS2.5-BI]
D21  PESD3V3L1BA-N  [SOD-323_L1.8-W1.3-LS2.5-BI]
D22  PESD3V3L1BA-N  [SOD-323_L1.8-W1.3-LS2.5-BI]
H1  HDR-F-2.54_2x15  [HDR-F-2.54_2X15]
J1  HDR-M-2.54_1x6  [HDR-M-2.54_1X6]
J2  HDR-M-2.54_1x4  [HDR-M-2.54_1X4]
J3  HDR-M-2.54_1x4  [HDR-M-2.54_1X4]
LED1  LED-TH-3mm_G  [LED-TH_BD3.0_GREEN]
PAD1  SNES Controller Port  [SNES CONTROLLER]
PAD2  SNES Controller Port  [SNES CONTROLLER]
R35  820Ω  [R0603]
R36  820Ω  [R0603]
R37  2kΩ  [R0402]
R38  2kΩ  [R0402]
R39  1kΩ  [R0402]
R40  1kΩ  [R0402]
R43  1kΩ  [R0402]
RN5  10kΩ  [RES-ARRAY-SMD_0402-8P-L2.0-W1.0-BL]
USB1  A/F90 PBTWhite plastic_C42615  [USB-A-TH_USB-M-40]
VGA1  L77HDE15SD1CH4R  [DB15-TH_L77HDE15SD1CH4R]
sheet Power Supply
C25  100uF  [CAP-SMD_BD8.0-L8.3-W8.3-LS9.9-FD]
C26  100uF  [CAP-SMD_BD8.0-L8.3-W8.3-LS9.9-FD]
C27  100uF  [CAP-SMD_BD8.0-L8.3-W8.3-LS9.9-FD]
C28  100uF  [CAP-SMD_BD8.0-L8.3-W8.3-LS9.9-FD]
C29  100nF  [C1206]
C30  100nF  [C1206]
C31  100nF  [C1206]
C32  100nF  [C1206]
DC1  DC-005-5A-2.5  [DC-IN-TH_DC-005-5A-2.5]
U11  BA33DD0T  [TO220FP-3]
U12  BA50DD0T  [TO220FP-3]
sheet RTC
B1  CR2032-BS-2-1  [BAT-TH_BS-2-1]
C35  6pF  [C0402]
C36  6pF  [C0402]
C37  100nF  [C0402]
U14  MCP79520-I/MS  [MSOP-10_L3.0-W3.0-P0.50-LS5.0-BL]
X4  32.768kHz  [CRYSTAL-SMD_L3.2-W1.5]
sheet Video Controller
C38  100nF  [C0402]
R6  402Ω  [R0402]
R7  200Ω  [R0402]
R8  402Ω  [R0402]
R9  402Ω  [R0402]
R10  402Ω  [R0402]
R11  200Ω  [R0402]
R12  200Ω  [R0402]
R13  200Ω  [R0402]
R14  324Ω  [R0402]
R15  402Ω  [R0402]
R16  324Ω  [R0402]
R17  200Ω  [R0402]
R18  402Ω  [R0402]
R19  200Ω  [R0402]
R20  402Ω  [R0402]
R21  200Ω  [R0402]
R22  200Ω  [R0402]
R23  402Ω  [R0402]
R24  402Ω  [R0402]
R25  324Ω  [R0402]
R26  200Ω  [R0402]
R27  402Ω  [R0402]
R28  200Ω  [R0402]
R29  402Ω  [R0402]
R30  200Ω  [R0402]
R31  200Ω  [R0402]
R32  402Ω  [R0402]
U7  VERA (Upduino 3.1)  [UPDUINO_3.0]
X3  25MHz  [OSC-SMD_4P-L3.2-W2.5-BL_SIT8008BI]

## Library data of the parts
C13 C16 = CL05A225MQ5NSNC: Supplier: LCSC; Manufacturer: SAMSUNG(三星); Supplier Part: C12530; JLCPCB Part Class: Basic Part
C1-C12 C14 C17 C23 C24 C33 C34 C37-C45 = CL05B104KO5NNNC: Supplier: LCSC; Manufacturer: SAMSUNG(三星); Supplier Part: C1525; JLCPCB Part Class: Basic Part
C15 C18 = CL21A106KAYNNNE: Supplier: LCSC; Manufacturer: SAMSUNG(三星); Supplier Part: C15850; JLCPCB Part Class: Basic Part
C19 C20 = 0402B222K500NT: Supplier: LCSC; Manufacturer: FH(风华); Supplier Part: C1531; JLCPCB Part Class: Basic Part
R33 R34 = 0402WGF4700TCE: Supplier: LCSC; Manufacturer: UNI-ROYAL(厚声); Supplier Part: C25117; Resistance (Ohms): 470; JLCPCB Part Class: Basic Part
R41 R42 R45-R49 = 0402WGF1002TCE: Supplier: LCSC; Manufacturer: UNI-ROYAL(厚声); Supplier Part: C25744; Resistance (Ohms): 10K; JLCPCB Part Class: Basic Part
R3 R44 R50 = 0402WGF3301TCE: Supplier: LCSC; Manufacturer: UNI-ROYAL(厚声); Supplier Part: C25890; Resistance (Ohms): 3.3K; JLCPCB Part Class: Basic Part
R39 R40 R43 R51-R56 = 0402WGF1001TCE: Supplier: LCSC; Manufacturer: UNI-ROYAL(厚声); Supplier Part: C11702; Resistance (Ohms): 1K; JLCPCB Part Class: Basic Part
U8 = PCM5100APWR: Supplier: LCSC; Manufacturer: TI(德州仪器); Contributor: LCSC; Supplier Part: C131154; JLCPCB Part Class: Extended Part; subpart_no: 1
U15 = LM3900DR: Supplier: LCSC; Supplier Part: C2057902; Manufacturer: TI(德州仪器); JLCPCB Part Class: Extended Part; Contributor: kylecardoza1; subpart_no: 1
R1 R2 R4 R5 = 0402WGF330JTCE: Supplier: LCSC; Manufacturer: UNI-ROYAL(厚声); Supplier Part: C25105; Resistance (Ohms): 33; JLCPCB Part Class: Basic Part
RN1-RN7 = 4D02WGJ0103TCE: Supplier: LCSC; Manufacturer: UNI-ROYAL(厚声); Supplier Part: C25725; Resistance (Ohms): 10K; JLCPCB Part Class: Basic Part
U1 = W65C265S8QG-8: Manufacturer: Western Design Center; Supplier: Mouser; Supplier Part: 955-W65C265S8QG-8; Contributor: kylecardoza1; JLCPCB Parts Class: Extended Part; subpart_no: 1
X1 = YF4032K76833T8188095: Supplier: LCSC; Supplier Part: C2831463; Manufacturer: JWT(晶威特); Contributor: LCSC; JLCPCB Part Class: Extended Part
X2 = SSW008000I3CHE-T: Supplier: LCSC; Supplier Part: C253918; Manufacturer: HELE(台湾加高); Contributor: LCSC; JLCPCB Part Class: Extended Part
P1 P2 = Turaco Cartridge (Female Edge Connector): Manufacturer: EDAC; Manufacturer Part: 395-062-520-350; Supplier Part: 587-395-062-520-350; Supplier: Mouser; Contributor: kylecardoza1
P3 = TURACO BACKPLANE (MALE EDGE CONNECTOR): Contributor: kylecardoza1
U3 U10 = SN74AHC138DR: Supplier: LCSC; Manufacturer: TI(德州仪器); Contributor: LCSC; Supplier Part: C132055; JLCPCB Part Class: Extended Part
U4 U13 = SN74AHC1G04DCKR (NOT GATE): Supplier: LCSC; Manufacturer: TI(德州仪器); Manufacturer Part: SN74AHC1G04DCKR; Supplier Part: C7466; JLCPCB Part Class: Extended Part; subpart_no: 1
U5 U6 = SN74AHC1G08DCKR (AND GATE): Supplier: LCSC; Supplier Part: C122838; Manufacturer: TI(德州仪器); Manufacturer Part: SN74AHC1G08DCKR; Contributor: LCSC; JLCPCB Part Class: Extended Part; subpart_no: 1
C21 C22 = C1005X5R1A335KTJ00E: Supplier: LCSC; Supplier Part: C695126; Manufacturer: TDK; Contributor: LCSC; JLCPCB Part Class: Extended Part
U9 = CH559T: Supplier: LCSC; Manufacturer: WCH(南京沁恒); Supplier Part: C85215; JLCPCB Part Class: Extended Part
U2 = IS61WV5128EDBLL-10TLI: Supplier: Mouser; Supplier Part: 870-61WV5128EDBLL10T; Manufacturer: ISSI; link: https://atta.szlcsc.com/upload/public/pdf/source/20210427/D29FB81B19EDD2CC050F8B4744B4027E.pdf; Contributor: lcsc
AUDIO = PJ-320B_C2884998: Supplier: LCSC; Supplier Part: C2884998; Manufacturer: XKB Connectivity(中国星坤); Manufacturer Part: PJ-320B; Contributor: LCSC; JLCPCB Part Class: Extended Part
CARD1 = SD-106M: Supplier: LCSC; Supplier Part: C266603; Manufacturer: XUNPU(讯普); Contributor: LCSC; JLCPCB Part Class: Extended Part
D1-D19 D21 D22 = PESD3V3L1BA-N: Supplier: LCSC; Supplier Part: C316020; Manufacturer: BORN(伯恩半导体); Contributor: LCSC; JLCPCB Part Class: Extended Part
H1 = HDR-F-2.54_2x15: Supplier Part: C169818; Supplier: LCSC; Contributor: LCEDA_Lib
J1 = HDR-M-2.54_1x6: Supplier Part: C190819; Supplier: LCSC; Contributor: LCEDA_Lib
J2 J3 = HDR-M-2.54_1x4: Supplier Part: C124378; Supplier: LCSC; Contributor: LCEDA_Lib
LED1 = LED-TH-3mm_G: Manufacturer: EVERLIGHT(台湾亿光); Manufacturer Part: 204-10SYGD/S530-E3; Supplier Part: C85161; Contributor: LCEDA_Lib
PAD1 PAD2 = SNES Controller Port: Contributor: kylecardoza1
R35 R36 = 0603WAF8200T5E: Supplier: LCSC; Manufacturer: UNI-ROYAL(厚声); Supplier Part: C23253; Resistance (Ohms): 820; JLCPCB Part Class: Basic Part
R37 R38 = 0402WGF2001TCE: Supplier: LCSC; Manufacturer: UNI-ROYAL(厚声); Supplier Part: C4109; Resistance (Ohms): 2K; JLCPCB Part Class: Basic Part
USB1 = A/F90 PBTWhite plastic_C42615: Supplier: LCSC; Manufacturer: 精拓金; Manufacturer Part: 905-251A1011D10100; Supplier Part: C42615; JLCPCB Part Class: Extended Part
VGA1 = L77HDE15SD1CH4R: Supplier: LCSC; Supplier Part: C464667; Manufacturer: Amphenol; Contributor: LCSC; JLCPCB Part Class: Extended Part
C25-C28 = EEEFN1H101P: Supplier: LCSC; Supplier Part: C494856; Manufacturer: PANASONIC(松下); Contributor: LCSC; JLCPCB Part Class: Extended Part
C29-C32 = CL31B104KBCNNNC: Supplier: LCSC; Manufacturer: SAMSUNG(三星); Supplier Part: C24497; JLCPCB Part Class: Basic Part
DC1 = DC-005-5A-2.5: Supplier: LCSC; Supplier Part: C381115; Manufacturer: XKB Connectivity(中国星坤); Contributor: LCSC; JLCPCB Part Class: Extended Part
U11 U12 = BA33DD0T: Manufacturer: ROHM Semiconductor; Supplier: Mouser; link: https://www.mouser.bg/ProductDetail/ROHM-Semiconductor/BA33DD0T?qs=%2Fha2pyFaduhoZ9RNBcGGmqVG%2FlIezkhVIA5M02IgxRc%3D; Contributor: Kaloyan
B1 = CR2032-BS-2-1: Supplier: LCSC; Manufacturer: Q&J; Manufacturer Part: BS-2-1; Supplier Part: C70376; JLCPCB Part Class: Extended Part
C35 C36 = 0402CG6R0C500NT_C30274: Supplier: LCSC; Manufacturer: null; Manufacturer Part: 0402CG6R0C500NT (SMT业务专用); Supplier Part: C30274; JLCPCB Part Class: Basic Part
U14 = MCP79520-I/MS: Supplier: LCSC; Manufacturer: MICROCHIP(美国微芯); Contributor: LCSC; Supplier Part: C144327; JLCPCB Part Class: Extended Part
X4 = X1A000091000500: Supplier: LCSC; Supplier Part: C255869; Manufacturer: EPSON(爱普生); JLCPCB Part Class: Extended Part; Contributor: LCSC
R6 R8-R10 R15 R18 R20 R23 R24 R27 R29 R32 = ERA2AEB4020X: Supplier: LCSC; Supplier Part: C490826; Manufacturer: PANASONIC(松下); Contributor: LCSC; JLCPCB Part Class: Extended Part
R7 R11-R13 R17 R19 R21 R22 R26 R28 R30 R31 = RTT02201JTH: Supplier: LCSC; Manufacturer: RALEC(旺诠); Supplier Part: C102874; Resistance (Ohms): 200; JLCPCB Part Class: Extended Part
R14 R16 R25 = ARG02FTC3240: Supplier: LCSC; Supplier Part: C284508; Manufacturer: Viking(光颉); Resistance (Ohms): 324; Contributor: LCSC; JLCPCB Part Class: Extended Part
U7 = Upduino 3.1: Manufacturer: TinyVision AI, Inc.; Contributor: kylecardoza
X3 = SG-8101CE-25.000000MHZ-TBGPA: Supplier: LCSC; Supplier Part: C390553; Manufacturer: EPSON(爱普生); Manufacturer Part: SG-8101CE 25.000000MHz TBGPA; Contributor: LCSC; JLCPCB Part Class: Extended Part

## Nets
+5V: C21.2 C23.2 C27.1 C31.2 C45.2 H1.1 J3.1 P3.1(+5V) PAD1.1(+5V) PAD2.1(+5V) U7.8(+5V) U9.19(VIIN5) U12.3(OUT) U15.14(VCC) USB1.1(VCC)
GND: AUDIO.3 B1.2 C1.1 C2.1 C3.1 C4.1 C5.1 C6.1 C7.1 C8.1 C9.1 C10.1 C11.1 C12.1 C14.1 C15.1 C16.1 C17.1 C18.1 C19.1 C20.1 C21.1 C22.1 C23.1 C24.1 C25.2 C26.2 C27.2 C28.2 C29.1 C30.1 C31.1 C32.1 C33.1 C34.1 C35.2 C36.2 C37.1 C38.1 C45.1 CARD1.3(VSS1) CARD1.6(VSS2) CARD1.12(SHELL) CARD1.13(SHELL) D1.1 D2.1 D3.1 D4.1 D5.1 D6.1 D7.1 D8.1 D9.1 D10.2 D11.2 D12.2 D13.2 D14.2 D15.2 D16.2 D17.2 D18.2 D19.2 D21.2 D22.2 DC1.2 DC1.3 H1.19 H1.20 H1.23 H1.24 J1.6 J2.4 J3.4 P1.2(GND) P1.36(GND) P1.64(GND) P2.2(GND) P2.36(GND) P2.64(GND) P3.60(GND) PAD1.7(GND) PAD2.7(GND) R7.1 R14.2 R16.2 R22.1 R25.2 R31.1 R37.1 R38.1 R43.2 R51.2 R52.2 R53.2 R54.2 R55.2 R56.2 RN4.1 RN4.2 RN4.3 RN7.5 RN7.6 RN7.7 U1.15(GND) U1.40(GND) U1.65(GND) U1.90(GND) U2.12(GND) U2.34(GND) U3.4(G2A) U3.5(G2B) U3.8(GND) U4.3(GND) U5.3(GND) U6.3(GND) U7.1(GND) U7.10(GND) U7.42(GND) U8.3(CPGND) U8.9(AGND) U8.10(DEMP) U8.11(FLT) U8.16(FMT) U8.19(DGND) U9.18(GND/VSS) U10.4(G2A) U10.5(G2B) U10.8(GND) U11.2(GND) U12.2(GND) U13.3(GND) U14.5(VSS) U15.1(1IN+) U15.2(2IN+) U15.7(GND) USB1.4(GND) USB1.5 USB1.6 VGA1.5 VGA1.6 VGA1.7 VGA1.8 VGA1.10 VGA1.16 VGA1.17 X1.2(GND) X2.2(GND) X3.2(GND)
VBAT: B1.1 U14.3(VBAT)
VCC: C1.2 C2.2 C3.2 C4.2 C5.2 C6.2 C7.2 C8.2 C9.2 C10.2 C11.2 C12.2 C22.2 C24.2 C25.1 C29.2 C33.2 C34.2 C37.2 C38.2 CARD1.4(VDD) H1.2 J1.4 J2.1 P1.4(VCC) P1.62(VCC) P2.4(VCC) P2.62(VCC) P3.2(VCC) R3.2 R41.1 RN1.5 RN1.6 RN1.7 RN1.8 RN2.5 RN2.6 RN2.7 RN2.8 RN3.5 RN3.6 RN3.7 RN3.8 RN4.4 RN5.5 RN5.6 RN5.7 RN5.8 RN6.5 RN6.6 RN6.7 RN6.8 U1.14(VCC) U1.41(VCC) U1.66(VCC) U1.89(VCC) U2.11(VDD) U2.33(VDD) U3.16(VCC) U4.5(VCC) U5.5(VCC) U6.5(VCC) U7.2(VCCIO) U8.8(AVDD) U8.20(DVDD) U9.20(VDD33) U10.16(VCC) U11.3(OUT) U13.5(VCC) U14.10(VCC) X1.1(Tri-State) X1.4(VDD) X2.1(OE) X2.4(VDD) X3.1(OE) X3.4(VCC)
VIN: C26.1 C28.1 C30.2 C32.2 DC1.1 U11.1(VCC) U12.1(VCC)
/CS0: RN2.1 U1.72(/CS0) U7.24(/CE)
/CS1: P1.33(/CS1) P2.33(/CS1) P3.37(/CS1) RN2.2 U1.73(/CS1)
/CS4: P1.63(/CS4) P2.63(/CS4) P3.38(/CS4) RN2.3 U1.80(/CS4)
/CS5: RN2.4 U1.81(/CS5) U2.8(CE#)
/CS6: P1.61(/CS6) P2.61(/CS6) P3.39(/CS6) RN3.1 U1.82(/CS6)
/CS7: P1.59(/CS7) P2.59(/CS7) P3.40(/CS7) RN3.2 U1.83(/CS7)
/IRQ: P1.27(/IRQ) P2.27(/IRQ) P3.43(/IRQ) RN1.3 U1.97(/IRQ)
/MRD: P1.31(/MRD) P2.31(/MRD) P3.35(/MRD) U2.37(OE#) U6.4(Y) U7.21(/MRD)
/MWR: P1.55(/MWR) P2.55(/MWR) P3.36(/MWR) U2.15(WE#) U5.4(Y) U7.17(/MWR)
/NMI: P1.25(/NMI) P2.25(/NMI) P3.42(/NMI) RN1.2 U1.75(P73) U1.96(/NMI)
/RES: P1.3(/RES) P2.3(/RES) P3.41(/RES) RN1.1 U1.26(/RES)
/SLOT0: P1.35(/SLOT) U10.15(Y0)
/SLOT1: P2.35(/SLOT) U10.14(Y1)
/SLOT2: P3.54(/SLOT2) U10.13(Y2)
/SLOT3: P3.55(/SLOT3) U10.12(Y3)
/SLOT4: P3.56(/SLOT4) U10.11(Y4)
/SLOT5: P3.57(/SLOT5) U10.10(Y5)
/SLOT6: P3.58(/SLOT6) U10.9(Y6)
/SLOT7: P3.59(/SLOT7) U10.7(Y7)
/SPI:MISO: P1.40(SPI:MISO) P2.40(SPI:MISO) P3.51(SPI:MISO)
/SPI:MOSI: P1.42(SPI:MOSI) P2.42(SPI:MOSI) P3.52(SPI:MOSI)
/SPI:SCK: P1.29(SPI:SCK) P2.29(SPI:SCK) P3.50(SPI:SCK)
/STATUS: RN3.4 U1.99(P43) U13.2(A)
/VIRQ: RN4.5 U1.22(/NE64) U7.15(/VIRQ)
/WE: RN1.4 U1.31(/WE) U4.2(A) U6.1(A)
A0: P1.6(A0) P2.6(A0) P3.3(A0) U1.42(A0) U2.3(A0) U7.7(A0)
A1: P1.7(A1) P2.7(A1) P3.4(A1) U1.43(A1) U2.4(A1) U7.6(A1)
A2: P1.8(A2) P2.8(A2) P3.5(A2) U1.44(A2) U2.5(A2) U7.18(A2)
A3: P1.9(A3) P2.9(A3) P3.6(A3) U1.45(A3) U2.6(A3) U7.5(A3)
A4: P1.10(A4) P2.10(A4) P3.7(A4) U1.46(A4) U2.7(A4) U7.19(A4)
A5: P1.11(A5) P2.11(A5) P3.8(A5) U1.47(A5) U2.16(A5)
A6: P1.12(A6) P2.12(A6) P3.9(A6) U1.48(A6) U2.17(A6)
A7: P1.13(A7) P2.13(A7) P3.10(A7) U1.49(A7) U2.18(A7)
A8: P1.14(A8) P2.14(A8) P3.11(A8) U1.50(A8) U2.19(A8)
A9: P1.15(A9) P2.15(A9) P3.12(A9) U1.55(A9) U2.20(A9)
A10: P1.16(A10) P2.16(A10) P3.13(A10) U1.56(A10) U2.26(A10)
A11: P1.17(A11) P2.17(A11) P3.14(A11) U1.57(A11) U2.27(A11)
A12: P1.18(A12) P2.18(A12) P3.15(A12) U1.58(A12) U2.28(A12)
A13: P1.19(A13) P2.19(A13) P3.16(A13) U1.59(A13) U2.29(A13)
A14: P1.20(A14) P2.20(A14) P3.17(A14) U1.60(A14) U2.30(A14)
A15: P1.21(A15) P2.21(A15) P3.18(A15) U1.61(A15) U2.38(A15)
A16: P1.22(A16) P2.22(A16) P3.19(A16) U1.62(A16) U2.39(A16)
A17: P1.24(A17) P2.24(A17) P3.20(A17) U1.63(A17) U2.40(A17)
A18: P1.26(A18) P2.26(A18) P3.21(A18) U1.64(A18) U2.41(A18)
A19: P1.28(A19) P2.28(A19) P3.22(A19) U1.67(A19)
A20: P1.30(A20) P2.30(A20) P3.23(A20) U1.68(A20)
A21: P1.32(A21) P2.32(A21) P3.24(A21) U1.69(A21)
A22: P1.34(A22) P2.34(A22) P3.25(A22) U1.70(A22)
A23: P1.38(A23) P2.38(A23) P3.26(A23) U1.71(A23)
AUDIO:BCK: H1.30 U7.23(AUDIO:BCK) U8.13(BCK)
AUDIO:DOUT: H1.28 U7.22(AUDIO:DOUT) U8.14(DIN)
AUDIO:L: AUDIO.1 D22.1 H1.21 R50.2 U15.5(1OUT)
AUDIO:L1: C39.1 P1.1(AUDIO:L)
AUDIO:L2: C40.1 P2.1(AUDIO:L)
AUDIO:LRCK: H1.29 U7.20(AUDIO:LRCK) U8.15(LRCK)
AUDIO:R: AUDIO.2 D21.1 H1.22 R44.2 U15.4(2OUT)
AUDIO:R1: C42.1 P1.5(AUDIO:R)
AUDIO:R2: C43.1 P2.5(AUDIO:R)
B0: H1.12 R32.2 U7.26(B0)
B1: H1.10 R29.2 U7.27(B1)
B2: H1.8 R27.2 U7.29(B2)
B3: H1.6 R24.2 U7.25(B3)
BE: R3.1 U1.35(BE)
BLUE: D3.2 R24.1 R25.1 R26.2 VGA1.3
CLK: U1.36(CLK) X1.3(OutPut)
CTS0: D13.1 J1.5 U1.18(P60)
D0: P1.43(D0) P2.43(D0) P3.27(D0) U1.84(D0) U2.9(D0) U7.14(D0)
D1: P1.44(D1) P2.44(D1) P3.28(D1) U1.85(D1) U2.10(D1) U7.13(D1)
D2: P1.45(D2) P2.45(D2) P3.29(D2) U1.86(D2) U2.13(D2) U7.12(D2)
D3: P1.46(D3) P2.46(D3) P3.30(D3) U1.87(D3) U2.14(D3) U7.11(D3)
D4: P1.47(D4) P2.47(D4) P3.31(D4) U1.88(D4) U2.31(D4) U7.39(D4)
D5: P1.48(D5) P2.48(D5) P3.32(D5) U1.91(D5) U2.32(D5) U7.44(D5)
D6: P1.49(D6) P2.49(D6) P3.33(D6) U1.92(D6) U2.35(D6) U7.37(D6)
D7: P1.50(D7) P2.50(D7) P3.34(D7) U1.93(D7) U2.36(D7) U7.36(D7)
D+: D14.1 J3.3 U9.14(P5.1/DP) USB1.3(D+)
D-: D15.1 J3.2 U9.15(P5.0/DM) USB1.2(D-)
DAC:L: C19.2 C41.1 R33.2
DAC:MUTE: H1.26 RN3.3 U1.98(P42) U8.17(XSMT)
DAC:R: C20.2 C44.1 R34.2
FCLK: U1.34(FCLK) X2.3(OUT)
G0: H1.13 R23.2 U7.30(G0)
G1: H1.15 R20.2 U7.31(G1)
G2: H1.16 R18.2 U7.33(G2)
G3: H1.14 R15.2 U7.34(G3)
GREEN: D2.2 R15.1 R16.1 R17.2 VGA1.2
HSYNC: D5.2 H1.17 R35.2 U7.32(HSYNC)
P53: RN7.2 U1.11(P53)
P57: RN7.3 U1.17(P57)
P65: RN7.4 U1.23(P65)
PAD:CLOCK: D7.2 PAD1.2(Clock) PAD2.2(Clock) U1.5(P45)
PAD:DATA0: D8.2 R38.2 R40.1 U1.6(P46)
PAD:DATA1: D9.2 R37.2 R39.1 U1.7(P47)
PAD:LATCH: D6.2 PAD1.3(Latch) PAD2.3(Latch) U1.100(P44)
PHI2: P1.37(PHI2) P2.37(PHI2) P3.53(PHI2) U1.38(PHI2) U5.2(B) U6.2(B)
R0: H1.5 R6.2 U7.43(R0)
R1: H1.7 R8.2 U7.35(R1)
R2: H1.9 R9.2 U7.40(R2)
R3: H1.11 R10.2 U7.38(R3)
RED: D1.2 R10.1 R13.2 R14.1 VGA1.1
RTS0: D10.1 J1.1 U1.19(P61)
RXD0: D11.1 J1.2 R5.2
RXD1: R1.2 U9.13(P2.7/TXD1)
SLOT:A0: RN6.2 U1.12(P54) U10.1(A)
SLOT:A1: RN6.3 U1.13(P55) U10.2(B)
SLOT:A2: RN6.4 U1.16(P56) U10.3(C)
SPI:A0: RN4.6 U1.8(P50) U3.1(A)
SPI:A1: RN4.7 U1.9(P51) U3.2(B)
SPI:A2: RN4.8 U1.10(P52) U3.3(C)
SPI:MISO: CARD1.7(DAT0) D19.1 RN5.2 U7.45(SPI_MISO) U14.7(SO)
SPI:MOSI: CARD1.2(CMD) D17.1 RN5.1 U7.46(SPI_MOSI) U14.6(SI)
SPI:SCK: CARD1.5(CLK) D18.1 U7.47(SPI_SCK) U14.8(SCK)
SPI:SS1: CARD1.1(CD/DAT3) D16.1 U3.14(Y1)
SPI:SS2: U3.13(Y2) U14.4(CS#)
SPI:SS3: P1.39(SPI:SS3) P2.39(SPI:SS3) P3.44(SPI:SS3) U3.12(Y3)
SPI:SS4: P1.41(SPI:SS4) P2.41(SPI:SS4) P3.46(SPI:SS4) U3.11(Y4)
SPI:SS5: P1.51(SPI:SS5) P2.51(SPI:SS5) P3.47(SPI:SS5) U3.10(Y5)
SPI:SS6: P1.53(SPI:SS6) P2.53(SPI:SS6) P3.48(SPI:SS6) U3.9(Y6)
SPI:SS7: P1.57(SPI:SS7) P2.57(SPI:SS7) P3.49(SPI:SS7) U3.7(Y7)
STATUS_LED: LED1.1 U13.4(Y)
SYSCLK: H1.27 U7.16(SYSCLK) U8.12(SCK) X3.3(OUT)
TG0: J2.2 U1.94(TG0)
TG1: J2.3 U1.95(TG1)
TXD0: D12.1 J1.3 R4.2
TXD1: R2.2 U9.12(P2.6/RXD1)
VERA:SS: U3.6(G1) U7.48(SPI_SS)
VSYNC: D4.2 H1.18 R36.2 U7.28(VSYNC)
Net-(C13-1): C13.1 U8.4(CAPM)
Net-(C13-2): C13.2 U8.2(CAPP)
Net-(C14-2): C14.2 C15.2 U8.1(CPVDD)
Net-(C16-2): C16.2 U8.5(VNEG)
Net-(C17-2): C17.2 C18.2 U8.18(LDOO)
Net-(C35-1): C35.1 U14.1(X1) X4.2(GND)
Net-(C36-1): C36.1 U14.2(X2) X4.1
Net-(C39-2): C39.2 R42.1 R51.1
Net-(C40-2): C40.2 R45.1 R52.1
Net-(C41-2): C41.2 R46.1 R53.1
Net-(C42-2): C42.2 R47.1 R56.1
Net-(C43-2): C43.2 R48.1 R55.1
Net-(C44-2): C44.2 R49.1 R54.1
Net-(CARD1-8): CARD1.8(DAT1) RN5.3
Net-(CARD1-9): CARD1.9(DAT2) RN5.4
Net-(LED1-2): LED1.2 R43.1
Net-(PAD1-4): PAD1.4(Data) R40.2
Net-(PAD2-4): PAD2.4(Data) R39.2
Net-(R1-1): R1.1 U1.24(RXD3)
Net-(R2-1): R2.1 U1.25(TXD3)
Net-(R4-1): R4.1 U1.21(TXD1)
Net-(R5-1): R5.1 U1.20(RXD1)
Net-(R6-1): R6.1 R7.2 R11.1
Net-(R8-1): R8.1 R11.2 R12.1
Net-(R9-1): R9.1 R12.2 R13.1
Net-(R17-1): R17.1 R18.1 R19.2
Net-(R19-1): R19.1 R20.1 R21.2
Net-(R21-1): R21.1 R22.2 R23.1
Net-(R26-1): R26.1 R27.1 R28.2
Net-(R28-1): R28.1 R29.1 R30.2
Net-(R30-1): R30.1 R31.2 R32.1
Net-(R33-1): R33.1 U8.6(OUTL)
Net-(R34-1): R34.1 U8.7(OUTR)
Net-(R35-1): R35.1 VGA1.13
Net-(R36-1): R36.1 VGA1.14
Net-(R41-2): R41.2 U10.6(G1)
Net-(R42-2): R42.2 R45.2 R46.2 R50.1 U15.6(1IN–)
Net-(R44-1): R44.1 R47.2 R48.2 R49.2 U15.3(2IN–)
Net-(U4.2-4): U4.4(Y) U5.1(A)

Not connected (* = marked no-connect by the designer): CARD1 10(CD)* 11(WP)*; H1 3* 4* 25*; P1 23(NC)* 52(NC)* 54(NC)* 56(NC)* 58(NC)* 60(NC)*; P2 23(NC)* 52(NC)* 54(NC)* 56(NC)* 58(NC)* 60(NC)*; PAD1 5(NC)* 6(NC)*; PAD2 5(NC)* 6(NC)*; RN6 1*; RN7 1* 8*; U1 1(NC)* 2(NC)* 3(NC)* 4(NC)* 27(NC)* 28(NC)* 29(NC)* 30(NC)* 32(RUN)* 33(/FCLKO)* 37(/CLKO)* 39(BA)* 51(NC)* 52(NC)* 53(NC)* 54(NC)* 74(P72)* 76(NC)* 77(NC)* 78(NC)* 79(NC)*; U2 1(NC)* 2(NC)* 21(NC)* 22(NC)* 23(NC)* 24(NC)* 25(NC)* 42(NC)* 43(NC)* 44(NC)*; U3 15(Y0)*; U4 1(NC)*; U7 3(/RES)* 4(CDONE)* 9(+3.3V)* 41(12MHz)*; U9 1(P1.2/AIN2/PWM3/CAP3)* 2(P1.4/AIN4/SCS)* 3(P1.5/AIN5/MOSI)* 4(P1.6/AIN6/MISO)* 5(P1.7/AIN7SCK)* 6(P5.7/RST)* 7(P3.2/LED0/INT0)* 8(P3.4/LEDC/T0)* 9(P4.6/XI/SCS_)* 10(P4.7/XO/SCK_)* 11(P2.5/TNOW/PWM2/T2EX/CAP2)* 16(P0.3/TXD)* 17(P0.2/RXD)*; U13 1(NC)*; U14 9(MFP)*; U15 8(3IN–)* 9(3OUT)* 10(4OUT)* 11(4IN–)* 12(4IN+)* 13(3IN+)*; VGA1 4* 9* 11* 12* 15*

## Notes on the sheets
sheet 1
- Address Bus
- Unused GPIO pins are pulled to ground
  via 10kΩ resistors, and should be left set
  to inputs.
- Data Bus
sheet 3
- Address Bus
- Data Bus
sheet 8
- Address Bus
- Data Bus
